# EAGLE design hybrid_lower_pcb3_2 (EAGLE 8.4.1)

## Sheet 1 of 8: micro,xbee,sd
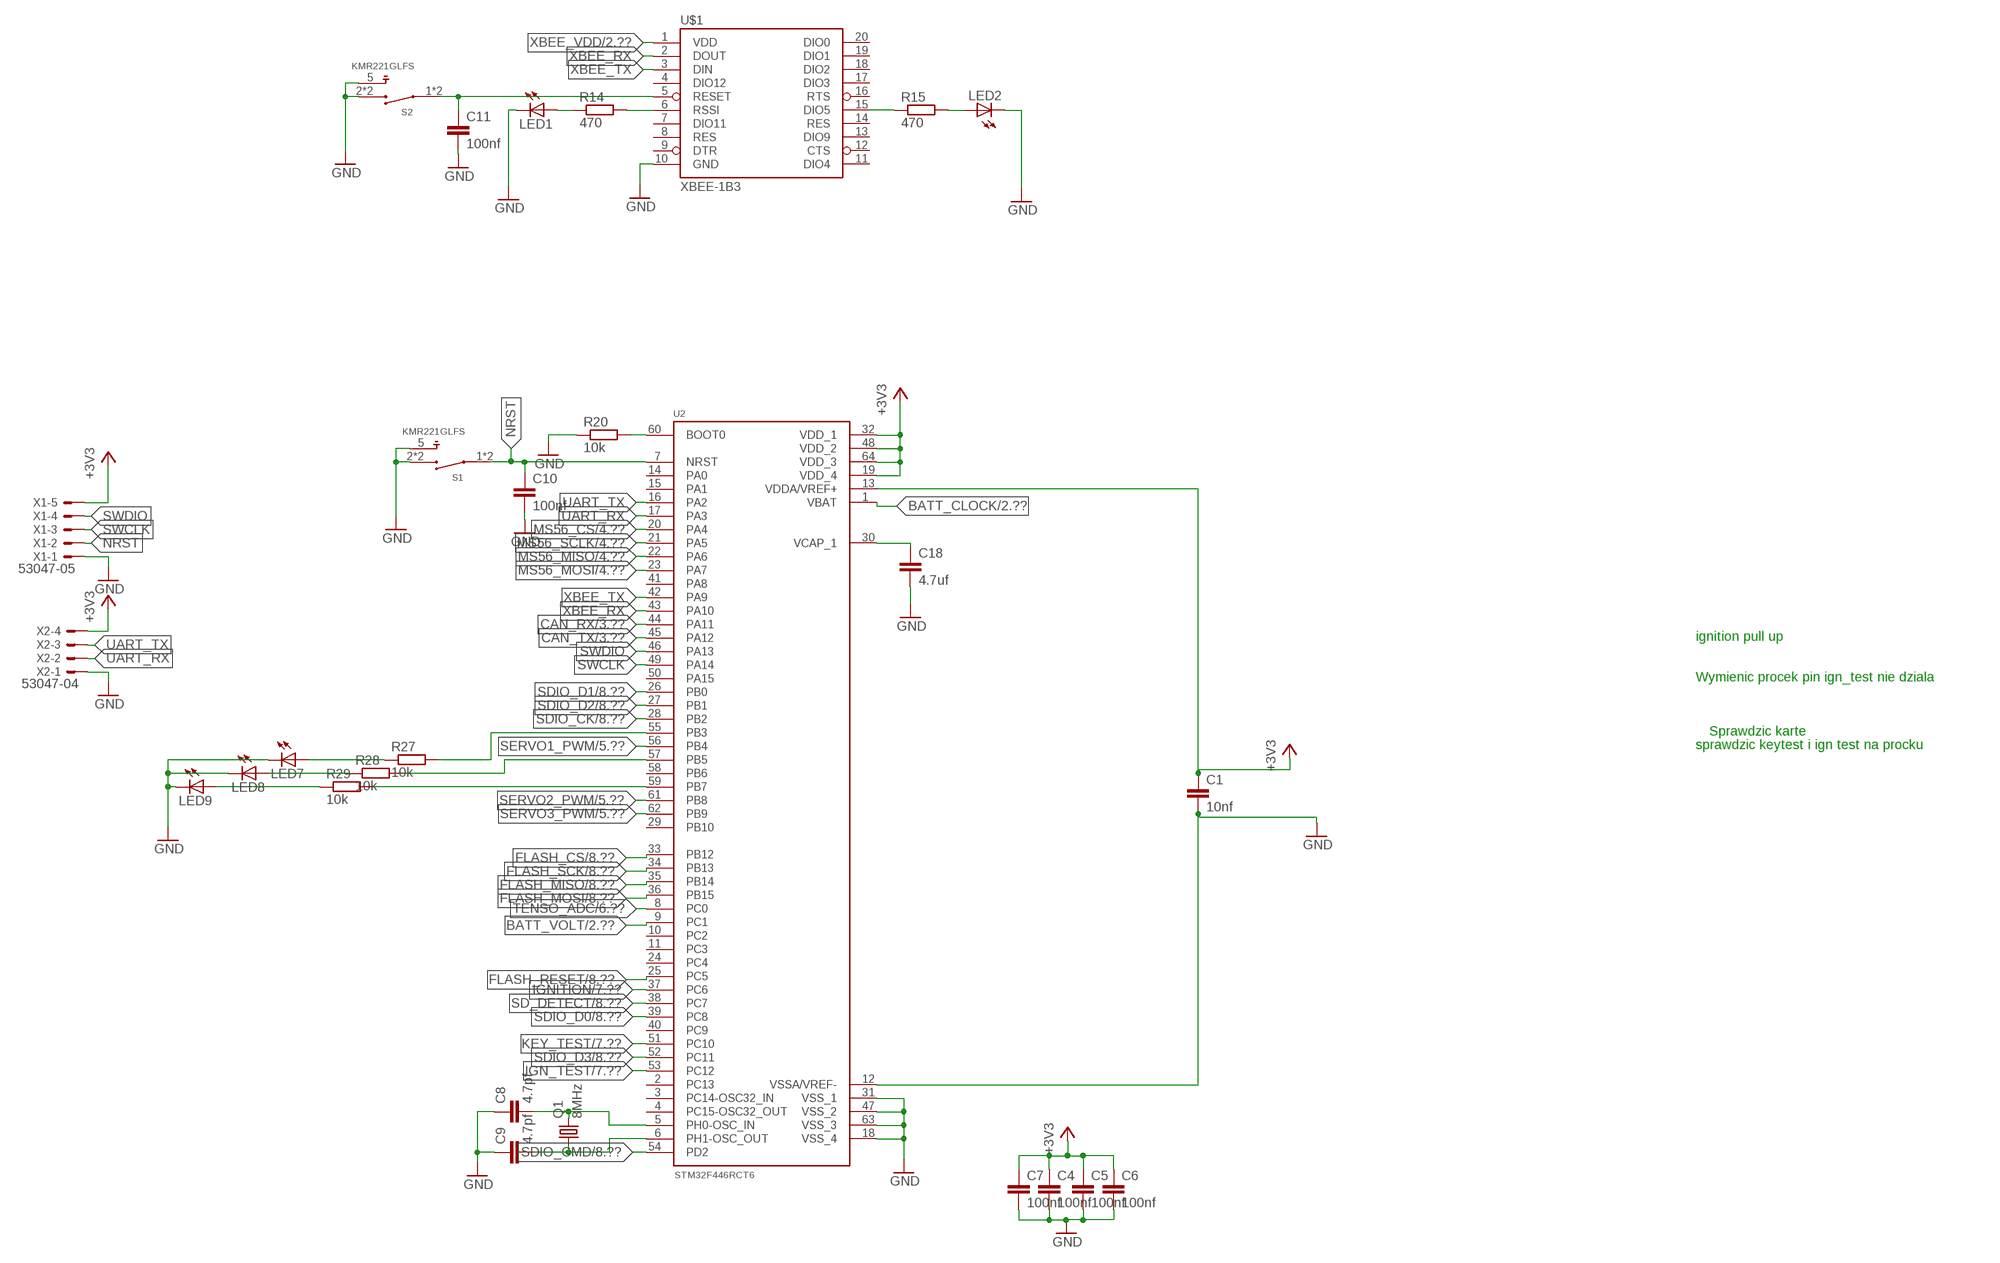
[diagram p0: schematic, sheet 1]

### Parts
C1  10nf  C-EUC0603  [C0603]
C4  100nf  C-EUC0603  [C0603]
C5  100nf  C-EUC0603  [C0603]
C6  100nf  C-EUC0603  [C0603]
C7  100nf  C-EUC0603  [C0603]
C8  4.7pf  C-EUC0603  [C0603]
C9  4.7pf  C-EUC0603  [C0603]
C10  100nf  C-EUC0603  [C0603]
C11  100nf  C-EUC0603  [C0603]
C18  4.7uf  C-EUC0805  [C0805]
LED1  LED0603  [LED-0603]
LED2  LED0603  [LED-0603]
LED7  LED0603  [LED-0603]
LED8  LED0603  [LED-0603]
LED9  LED0603  [LED-0603]
Q1  8MHz  CRYSTALCTS406  [CTS406]
R14  470  R-EU_R0603  [R0603]
R15  470  R-EU_R0603  [R0603]
R20  10k  R-EU_R0603  [R0603]
R27  10k  R-EU_R0603  [R0603]
R28  10k  R-EU_R0603  [R0603]
R29  10k  R-EU_R0603  [R0603]
S1  KMR221GLFS  [SW_KMR221GLFS]
S2  KMR221GLFS  [SW_KMR221GLFS]
U2  STM32F446RCT6  [QFP50P1200X1200X160-64N]
U$1  XBEE-1B3  [XBEE-SMD]
X1  53047-05  [53047-05]
X2  53047-04  [53047-04]

### Nets
+3V3: C1.1 C4.1 C5.1 C6.1 C7.1 U2.13(VDDA/VREF+) U2.19(VDD_4) U2.32(VDD_1) U2.48(VDD_2) U2.64(VDD_3) X1.5 X2.4 ; also sheet 2,3,4,7,8
BATT_CLOCK: U2.1(VBAT) ; also sheet 2
BATT_VOLT: U2.9(PC1) ; also sheet 2
CAN_RX: U2.44(PA11) ; also sheet 3
CAN_TX: U2.45(PA12) ; also sheet 3
DUPA: C11.1 S2.1 S2.4 U$1.5(RESET)
FLASH_CS: U2.33(PB12) ; also sheet 8
FLASH_MISO: U2.35(PB14) ; also sheet 8
FLASH_MOSI: U2.36(PB15) ; also sheet 8
FLASH_RESET: U2.25(PC5) ; also sheet 8
FLASH_SCK: U2.34(PB13) ; also sheet 8
GND: C1.2 C4.2 C5.2 C6.2 C7.2 C8.1 C9.1 C10.2 C11.2 C18.2 LED1.C LED2.C LED7.C LED8.C LED9.C R20.1 S1.2 S1.3 S1.5 S2.2 S2.3 S2.5 U2.12(VSSA/VREF-) U2.18(VSS_4) U2.31(VSS_1) U2.47(VSS_2) U2.63(VSS_3) U$1.10(GND) X1.1 X2.1 ; also sheet 2,3,4,5,6,7,8
IGN_TEST: U2.53(PC12) ; also sheet 7
IGNITION: U2.37(PC6) ; also sheet 7
KEY_TEST: U2.51(PC10) ; also sheet 7
MS56_CS: U2.20(PA4) ; also sheet 4
MS56_MISO: U2.22(PA6) ; also sheet 4
MS56_MOSI: U2.23(PA7) ; also sheet 4
MS56_SCLK: U2.21(PA5) ; also sheet 4
N$2: C18.1 U2.30(VCAP_1)
N$7: LED1.A R14.1
N$8: C8.2 Q1.3 U2.5(PH0-OSC_IN)
N$9: C9.2 Q1.1 U2.6(PH1-OSC_OUT)
N$11: LED2.A R15.2
N$18: R14.2 U$1.6(RSSI)
N$19: R15.1 U$1.15(DIO5)
N$29: R20.2 U2.60(BOOT0)
N$30: R27.2 U2.55(PB3)
N$33: R28.2 U2.57(PB5)
N$34: R29.2 U2.59(PB7)
N$36: LED7.A R27.1
N$37: LED8.A R28.1
N$38: LED9.A R29.1
NRST: C10.1 S1.1 S1.4 U2.7(NRST) X1.2
SD_DETECT: U2.38(PC7) ; also sheet 8
SDIO_CK: U2.28(PB2) ; also sheet 8
SDIO_CMD: U2.54(PD2) ; also sheet 8
SDIO_D0: U2.39(PC8) ; also sheet 8
SDIO_D1: U2.26(PB0) ; also sheet 8
SDIO_D2: U2.27(PB1) ; also sheet 8
SDIO_D3: U2.52(PC11) ; also sheet 8
SERVO1_PWM: U2.56(PB4) ; also sheet 5
SERVO2_PWM: U2.61(PB8) ; also sheet 5
SERVO3_PWM: U2.62(PB9) ; also sheet 5
SWCLK: U2.49(PA14) X1.3
SWDIO: U2.46(PA13) X1.4
TENSO_ADC: U2.8(PC0) ; also sheet 6
UART_RX: U2.17(PA3) X2.2
UART_TX: U2.16(PA2) X2.3
XBEE_RX: U2.43(PA10) U$1.2(DOUT)
XBEE_TX: U2.42(PA9) U$1.3(DIN)
XBEE_VDD: U$1.1(VDD) ; also sheet 2
Unconnected: U2.2(PC13) U2.3(PC14-OSC32_IN) U2.4(PC15-OSC32_OUT) U2.10(PC2) U2.11(PC3) U2.14(PA0) U2.15(PA1) U2.24(PC4) U2.29(PB10) U2.40(PC9) U2.41(PA8) U2.50(PA15) U2.58(PB6) U$1.4(DIO12) U$1.7(DIO11) U$1.8(RES) U$1.9(DTR) U$1.11(DIO4) U$1.12(CTS) U$1.13(DIO9) U$1.14(RES) U$1.16(RTS) U$1.17(DIO3) U$1.18(DIO2) U$1.19(DIO1) U$1.20(DIO0)

### Notes on the sheet
- ignition pull up
- Wymienic procek pin ign_test nie dziala
- Sprawdzic karte
- sprawdzic keytest i ign test na procku

## Sheet 2 of 8: supply
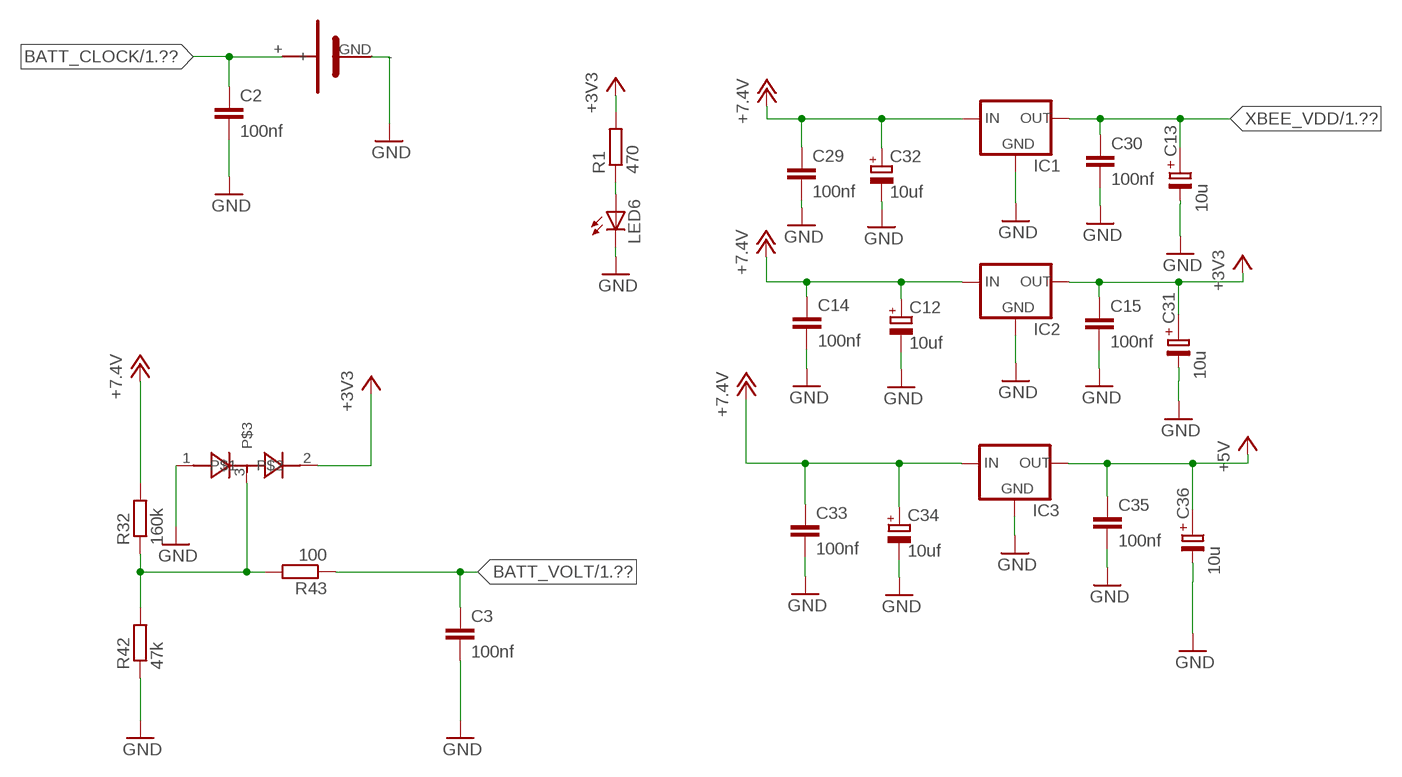
[diagram p1: schematic, sheet 2]

### Parts
C2  100nf  C-EUC0603  [C0603]
C3  100nf  C-EUC0603  [C0603]
C12  10uf  CPOL-EUSANYO_SMD_B6  [SANYO-OSCON_SMD_B6]
C13  10u  C-PR-SMD-TE-B  [TE-B-3528]
C14  100nf  C-EUC0603  [C0603]
C15  100nf  C-EUC0603  [C0603]
C29  100nf  C-EUC0603  [C0603]
C30  100nf  C-EUC0603  [C0603]
C31  10u  C-PR-SMD-TE-B  [TE-B-3528]
C32  10uf  CPOL-EUSANYO_SMD_B6  [SANYO-OSCON_SMD_B6]
C33  100nf  C-EUC0603  [C0603]
C34  10uf  CPOL-EUSANYO_SMD_B6  [SANYO-OSCON_SMD_B6]
C35  100nf  C-EUC0603  [C0603]
C36  10u  C-PR-SMD-TE-B  [TE-B-3528]
IC1  LM1117  [SOT223]
IC2  LM1117  [SOT223]
IC3  LM1117  [SOT223]
LED6  LED0603  [LED-0603]
R1  470  R-EU_R0603  [R0603]
R32  160k  R-EU_R0603  [R0603]
R42  47k  R-EU_R0603  [R0603]
R43  100  R-EU_R0603  [R0603]
U$13  CR1220_POZ  [CR1220_POZ]
U$17  BAS40W-04  [SOT65P210X110-3N]

### Nets
+3V3: C15.1 C31.+ IC2.2(OUT) R1.2 U$17.2 ; also sheet 1,3,4,7,8
+5V: C35.1 C36.+ IC3.2(OUT) ; also sheet 5,6
+12V: C12.+ C14.1 C29.1 C32.+ C33.1 C34.+ IC1.3(IN) IC2.3(IN) IC3.3(IN) R32.2 ; supply symbol labelled +7.4V ; also sheet 5,7
BATT_CLOCK: C2.1 U$13.+ ; also sheet 1
BATT_VOLT: C3.1 R43.1 ; also sheet 1
GND: C2.2 C3.2 C12.- C13.- C14.2 C15.2 C29.2 C30.2 C31.- C32.- C33.2 C34.- C35.2 C36.- IC1.1(GND) IC2.1(GND) IC3.1(GND) LED6.C R42.1 U$13.GND(-) U$17.1 ; also sheet 1,3,4,5,6,7,8
N$6: R32.1 R42.2 R43.2 U$17.3
N$28: LED6.A R1.1
XBEE_VDD: C13.+ C30.1 IC1.2(OUT) ; also sheet 1

## Sheet 3 of 8: CAN
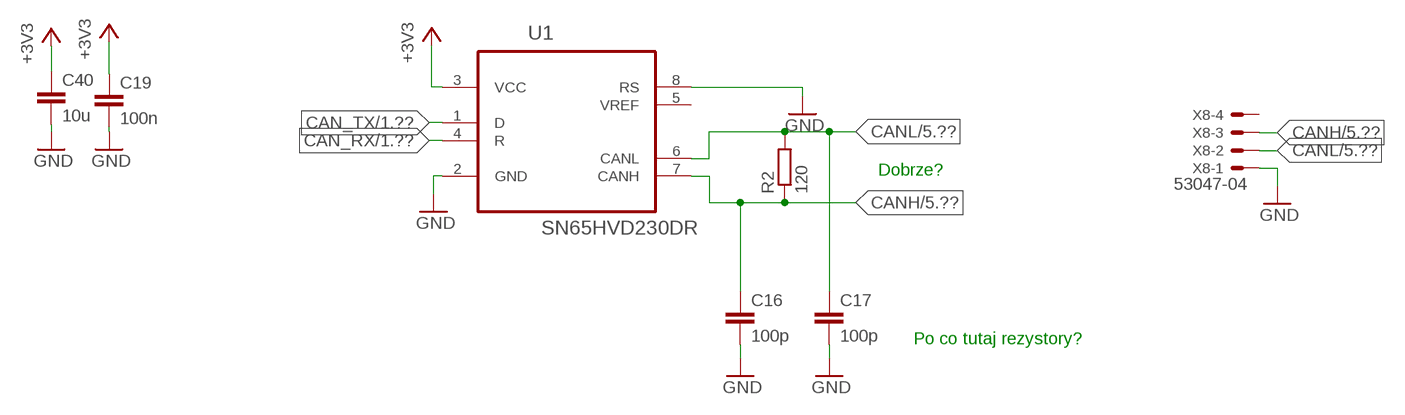
[diagram p2: schematic, sheet 3]

### Parts
C16  100p  C-EUC0603  [C0603]
C17  100p  C-EUC0603  [C0603]
C19  100n  C-EUC0603  [C0603]
C40  10u  C-EUC0805  [C0805]
R2  120  R-EU_R0603  [R0603]
U1  SN65HVD230DR  [SOIC127P600X175-8N]
X8  53047-04  [53047-04]

### Nets
+3V3: C19.1 C40.1 U1.3(VCC) ; also sheet 1,2,4,7,8
CAN_RX: U1.4(R) ; also sheet 1
CAN_TX: U1.1(D) ; also sheet 1
CANH: C16.1 R2.1 U1.7(CANH) X8.3 ; also sheet 5
CANL: C17.1 R2.2 U1.6(CANL) X8.2 ; also sheet 5
GND: C16.2 C17.2 C19.2 C40.2 U1.2(GND) U1.8(RS) X8.1 ; also sheet 1,2,4,5,6,7,8
Unconnected: U1.5(VREF) X8.4

### Notes on the sheet
- Dobrze?
- Po co tutaj rezystory?

## Sheet 4 of 8: Altimeter
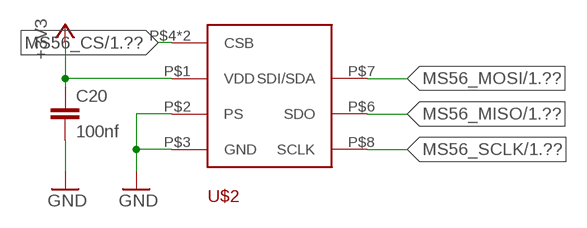
[diagram p3: schematic, sheet 4]

### Parts
C20  100nf  C-EUC0603  [C0603]
U$2  MS56XX  [MS56XX]

### Nets
+3V3: C20.1 U$2.P$1(VDD) ; also sheet 1,2,3,7,8
GND: C20.2 U$2.P$2(PS) U$2.P$3(GND) ; also sheet 1,2,3,5,6,7,8
MS56_CS: U$2.P$4(CSB) U$2.P$5(CSB) ; also sheet 1
MS56_MISO: U$2.P$6(SDO) ; also sheet 1
MS56_MOSI: U$2.P$7(SDI/SDA) ; also sheet 1
MS56_SCLK: U$2.P$8(SCLK) ; also sheet 1

## Sheet 5 of 8: connection
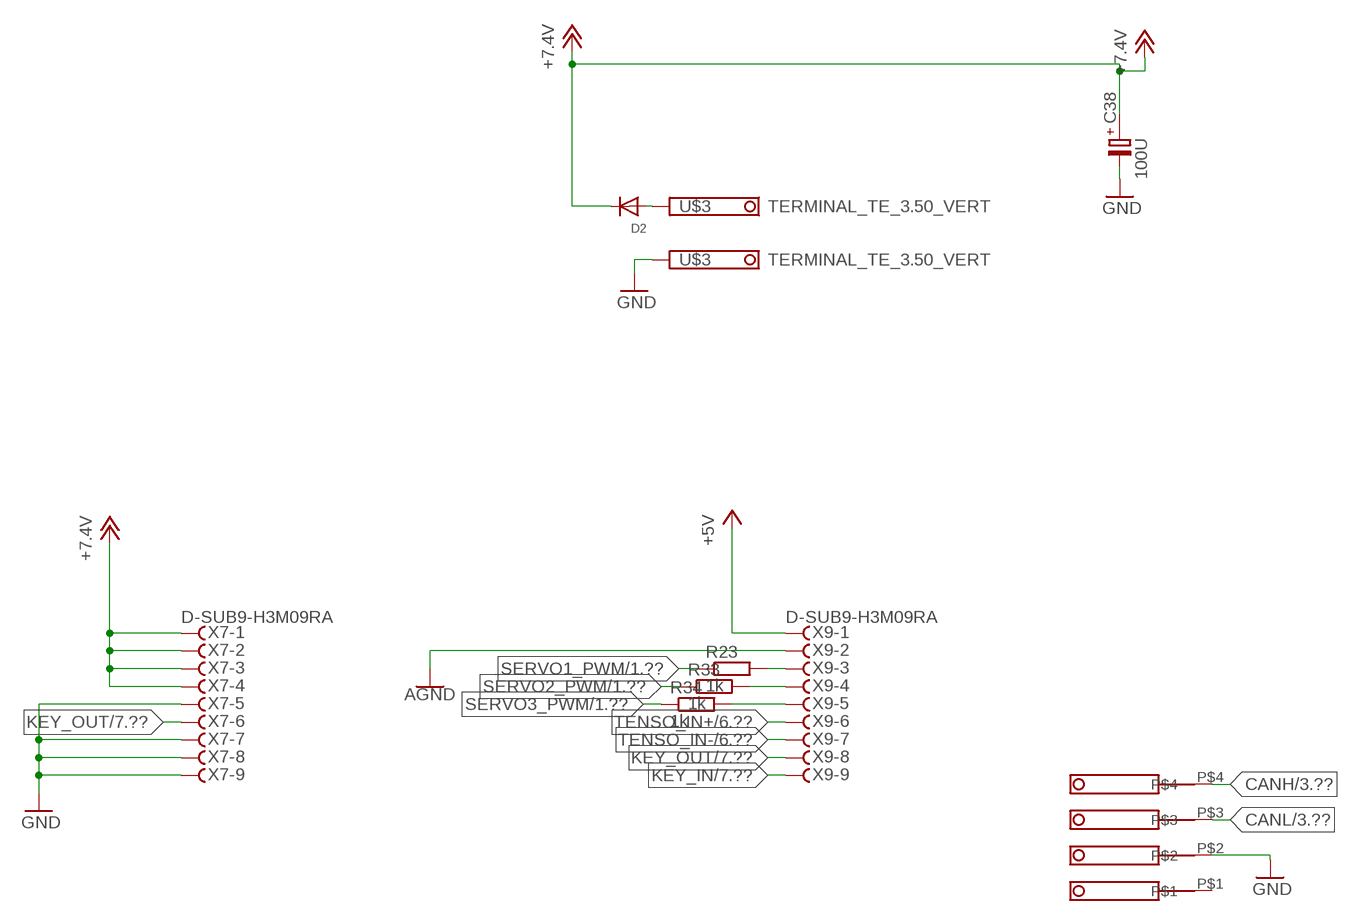
[diagram p4: schematic, sheet 5]

### Parts
C38  100U  C-PR-SMD-TE-B  [TE-B-3528]
D2  DIODESOD-523  [SOD-523]
R23  1k  R-EU_R0603  [R0603]
R33  1k  R-EU_R0603  [R0603]
R34  1k  R-EU_R0603  [R0603]
U$3  TERMINAL_TE_3.50_VERT  [TE_3.5_TERMINAL_VERT]
U$10  39505-1005  [39505-1005]
X7  D-SUB9-H3M09RA  [H3M09RA]
X9  D-SUB9-H3M09RA  [H3M09RA]

### Nets
+5V: X9.1 ; also sheet 2,6
+12V: C38.+ D2.K(C) X7.1 X7.2 X7.3 X7.4 ; supply symbol labelled +7.4V ; also sheet 2,7
AGND: X9.2 ; also sheet 6
CANH: U$10.P$4 ; also sheet 3
CANL: U$10.P$3 ; also sheet 3
GND: C38.- U$3.P$2(K1) U$10.P$2 X7.5 X7.7 X7.8 X7.9 ; also sheet 1,2,3,4,6,7,8
KEY_IN: X9.9 ; also sheet 7
KEY_OUT: X7.6 X9.8 ; also sheet 7
N$17: D2.A U$3.P$1(K)
N$22: R23.2 X9.3
N$23: R33.2 X9.4
N$24: R34.2 X9.5
SERVO1_PWM: R23.1 ; also sheet 1
SERVO2_PWM: R33.1 ; also sheet 1
SERVO3_PWM: R34.1 ; also sheet 1
TENSO_IN+: X9.6 ; also sheet 6
TENSO_IN-: X9.7 ; also sheet 6
Unconnected: U$10.P$1

## Sheet 6 of 8
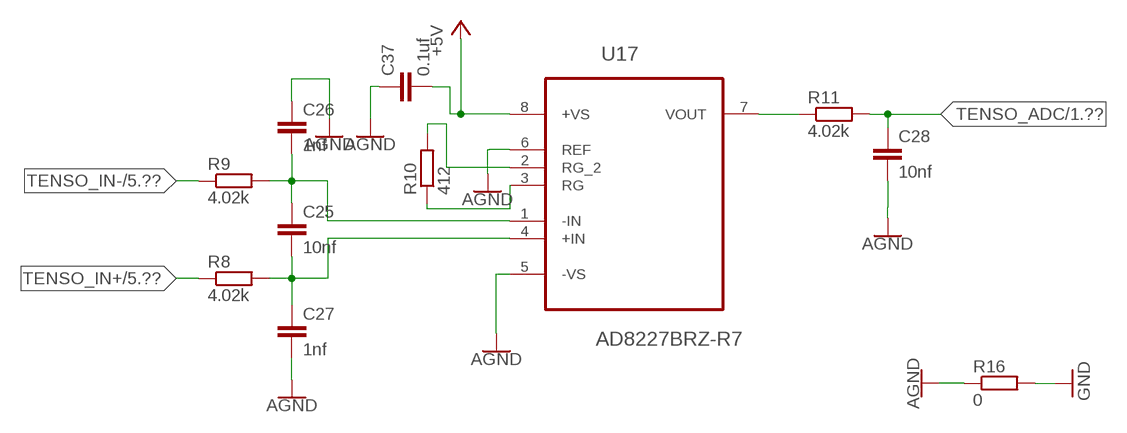
[diagram p5: schematic, sheet 6]

### Parts
C25  10nf  C-EUC0603  [C0603]
C26  1nf  C-EUC0603  [C0603]
C27  1nf  C-EUC0603  [C0603]
C28  10nf  C-EUC0603  [C0603]
C37  0.1uf  C-EUC0603  [C0603]
R8  4.02k  R-EU_R0603  [R0603]
R9  4.02k  R-EU_R0603  [R0603]
R10  412  R-EU_R0805  [R0805]
R11  4.02k  R-EU_R0603  [R0603]
R16  0  R-EU_R0603  [R0603]
U17  AD8227BRZ-R7  [SOIC127P600X175-8N]

### Nets
+5V: C37.2 U17.8(+VS) ; also sheet 2,5
AGND: C26.1 C27.2 C28.2 C37.1 R16.1 U17.5(-VS) U17.6(REF) ; also sheet 5
GND: R16.2 ; also sheet 1,2,3,4,5,7,8
N$3: C25.1 C26.2 R9.2 U17.1(-IN)
N$4: C25.2 C27.1 R8.2 U17.4(+IN)
N$10: R10.1 U17.3(RG)
N$15: R10.2 U17.2(RG_2)
N$16: R11.1 U17.7(VOUT)
TENSO_ADC: C28.1 R11.2 ; also sheet 1
TENSO_IN+: R8.1 ; also sheet 5
TENSO_IN-: R9.1 ; also sheet 5

## Sheet 7 of 8: Ignition
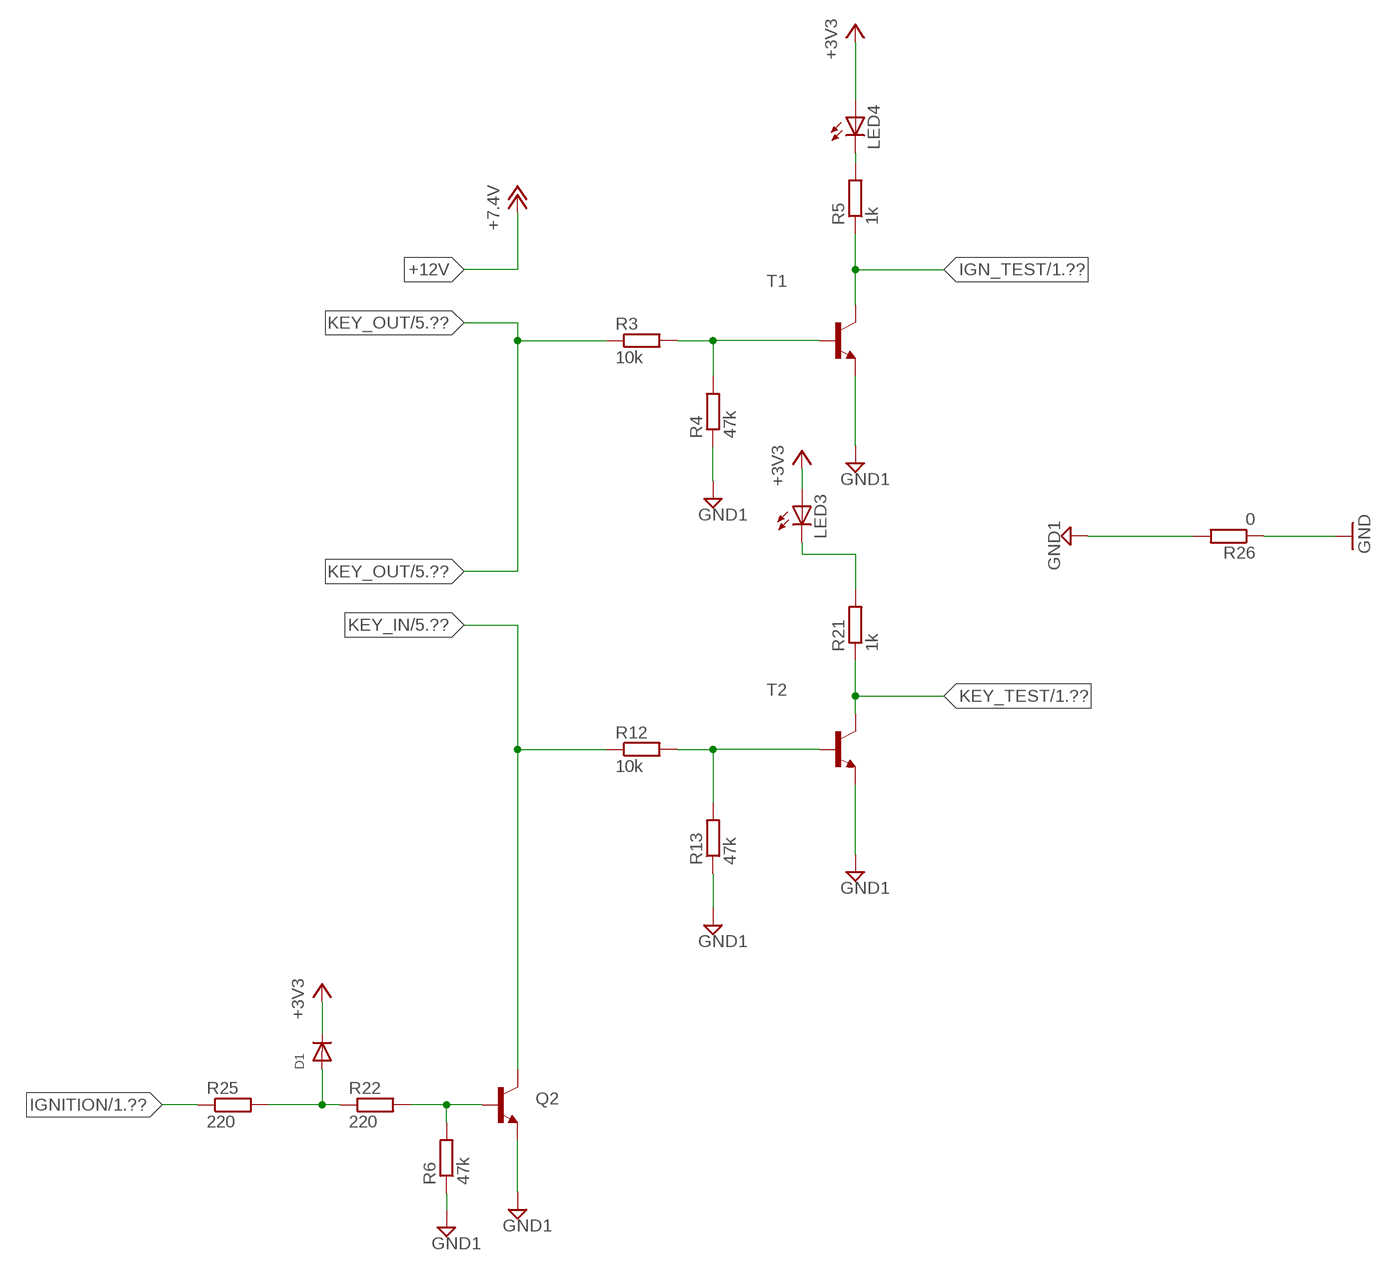
[diagram p6: schematic, sheet 7]

### Parts
D1  DIODESOD-523  [SOD-523]
LED3  LED0603  [LED-0603]
LED4  LED0603  [LED-0603]
Q2  TRANSISTOR_NPNSOT23-3  [SOT23-3]
R3  10k  R-EU_R0603  [R0603]
R4  47k  R-EU_R0603  [R0603]
R5  1k  R-EU_R0603  [R0603]
R6  47k  R-EU_R0603  [R0603]
R12  10k  R-EU_R0603  [R0603]
R13  47k  R-EU_R0603  [R0603]
R21  1k  R-EU_R0603  [R0603]
R22  220  R-EU_R0603  [R0603]
R25  220  R-EU_R0603  [R0603]
R26  0  R-EU_R0603  [R0603]
T1  BCW81-NPN-SOT23-BEC  [SOT23-BEC]
T2  BCW81-NPN-SOT23-BEC  [SOT23-BEC]

### Nets
+3V3: D1.K(C) LED3.A LED4.A ; also sheet 1,2,3,4,8
GND: R26.1 ; also sheet 1,2,3,4,5,6,8
GND1: Q2.2(E) R4.1 R6.1 R13.1 R26.2 T1.E T2.E
IGN_TEST: R5.1 T1.C ; also sheet 1
IGNITION: R25.1 ; also sheet 1
KEY_IN: Q2.3(C) R12.1 ; also sheet 5
KEY_OUT: R3.1 ; also sheet 5
KEY_TEST: R21.1 T2.C ; also sheet 1
N$5: R3.2 R4.2 T1.B
N$12: R12.2 R13.2 T2.B
N$20: LED4.C R5.2
N$21: LED3.C R21.2
N$31: Q2.1(B) R6.2 R22.2
N$35: D1.A R22.1 R25.2

## Sheet 8 of 8: Memory
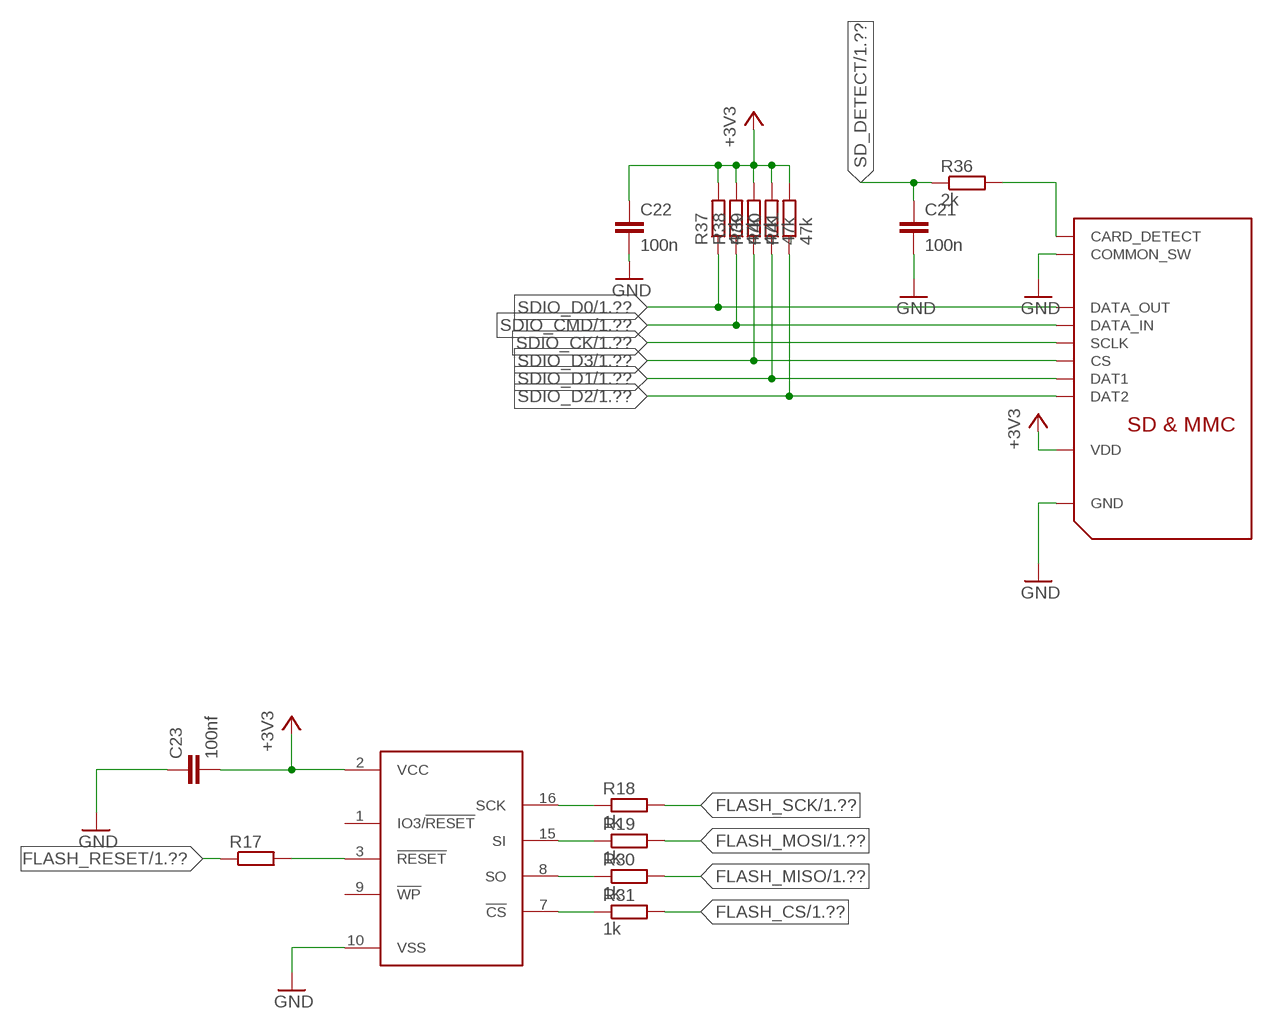
[diagram p7: schematic, sheet 8]

### Parts
C21  100n  C-EUC0603K  [C0603K]
C22  100n  C-EUC0603K  [C0603K]
C23  100nf  C-EUC0603  [C0603]
R17  R-EU_R0603  [R0603]
R18  1k  R-EU_R0603  [R0603]
R19  1k  R-EU_R0603  [R0603]
R30  1k  R-EU_R0603  [R0603]
R31  1k  R-EU_R0603  [R0603]
R36  2k  R-EU_R0603  [R0603]
R37  47k  R-EU_R0603  [R0603]
R38  47k  R-EU_R0603  [R0603]
R39  47k  R-EU_R0603  [R0603]
R40  47k  R-EU_R0603  [R0603]
R41  47k  R-EU_R0603  [R0603]
U$11  S25FLX  [SOIC16]
U$16  MOLEX_MICRO_SD_503182-1853  [MOLEX_MICRO_SD_503182-1853]

### Nets
+3V3: C22.1 C23.2 R37.2 R38.2 R39.2 R40.2 R41.2 U$11.2(VCC) U$16.PIN4(VDD) ; also sheet 1,2,3,4,7
FLASH_CS: R31.2 ; also sheet 1
FLASH_MISO: R30.2 ; also sheet 1
FLASH_MOSI: R19.2 ; also sheet 1
FLASH_RESET: R17.1 ; also sheet 1
FLASH_SCK: R18.2 ; also sheet 1
GND: C21.2 C22.2 C23.1 U$11.10(VSS) U$16.DETECT_GND(COMMON_SW) U$16.PIN6(GND) ; also sheet 1,2,3,4,5,6,7
N$1: R36.2 U$16.DETECT(CARD_DETECT)
N$14: R17.2 U$11.3(!RESET)
N$25: R18.1 U$11.16(SCK)
N$32: R19.1 U$11.15(SI)
N$39: R30.1 U$11.8(SO)
N$40: R31.1 U$11.7(!CS)
SD_DETECT: C21.1 R36.1 ; also sheet 1
SDIO_CK: U$16.PIN5(SCLK) ; also sheet 1
SDIO_CMD: R38.1 U$16.PIN3(DATA_IN) ; also sheet 1
SDIO_D0: R37.1 U$16.PIN7(DATA_OUT) ; also sheet 1
SDIO_D1: R40.1 U$16.PIN8(DAT1) ; also sheet 1
SDIO_D2: R41.1 U$16.PIN1(DAT2) ; also sheet 1
SDIO_D3: R39.1 U$16.PIN2(CS) ; also sheet 1
Unconnected: U$11.1(IO3/!RESET) U$11.9(!WP)

## Library data of the parts
C1 C2 C4-C11 C14-C17 C19 C21 C22 C25-C30 C33 C35 C37 C40 = rcl:C-EU: CAPACITOR, European symbol
C3 C18 C23 = rcl:C-EU: CAPACITOR, European symbol; SPICEPREFIX: C
C12 C32 C34 = rcl:CPOL-EU: POLARIZED CAPACITOR, European symbol; SPICEPREFIX: C
C13 C31 C36 C38 = capacitors:C-PR: POLARIZED ELECTROLYTIC/TANTALUM
C20 = resistor:C-EU: CAPACITOR, European symbol
D1 D2 = adafruit:DIODE: Diode SMADIODE - SMA Surface Mount Package 20V 1A Schottky Diode Digikey: 641-1014-6-ND DO-1N4148 - Through Hole Small Current Diode SOD-123 20V 1 A (.5mV Vf) Schottky Diode - Digikey: MBRX120TPMSCT-ND SOD-323 10V 570mA (.38mV Vf, 3ns) Schottky Diode - Digikey: ZLLS410CT-ND SOD-523 30V 30mA Schottky Diode (RB751S-40TE61) - Digikey: RB751S-40TE61CT-ND SOT23-R/W - SOT23 Package (R = Solder Paste/Reflow Ovens, W = Hand-Soldering) BAT54Film 40V 300mA - Digikey: 497-7162-1-ND
IC1-IC3 = v-reg-3:LM1117
LED1-LED4 LED6-LED9 = SparkFun:LED: LEDs Standard schematic elements and footprints for 5mm, 3mm, 1206, and 0603 sized LEDs. 5mm - Spark Fun Electronics SKU : COM-00529 (and others)
Q1 = crystal:CRYSTAL: CRYSTAL; OC_FARNELL: unknown; OC_NEWARK: unknown
Q2 = SparkFun:TRANSISTOR_NPN: Transistor NPN BJT configuration in SOT23 package. MMBT2222 is the common NPN we use. Double check BCE configuration again layout.
R1 R16 R20 R27-R29 = resistor:R-EU_: RESISTOR, European symbol
R2-R6 R8-R15 R21 R22 R25 R26 R36-R41 = rcl:R-EU_: RESISTOR, European symbol
R17-R19 R23 R30-R34 R42 R43 = rcl:R-EU_: RESISTOR, European symbol; SPICEPREFIX: R
S1 S2 = KMR221GLFS:KMR221GLFS: Switch Tactile N.O. SPST Button Gull Wing 0.05A 32VDC 1VA 200000Cycles 2N SMD Automotive T/R; AVAILABILITY: Good; DESCRIPTION: Switch Tactile N.O. SPST Button Gull Wing 0.05A 32VDC 1VA 200000Cycles 2N SMD Automotive T/R; MF: C&K Components; MP: KMR221GLFS; PACKAGE: None; PRICE: 0.28 USD
T1 T2 = DC_LOAD_AU:*-NPN-: NPN Transistror BF959 corrected 2008.03.06
U1 = SN65HVD230DR:SN65HVD230DR: 3.3-V CAN TRANSCEIVERS; AVAILABILITY: Good; DESCRIPTION: 3.3V CAN Transceiver with Standby Mode 8-SOIC -40 to 85; MF: Texas Instruments; MP: SN65HVD230DR; PACKAGE: SOIC-8 Texas Instruments; PRICE: 1.59 USD
U2 = STM32F446RCT6:STM32F446RCT6: 32 Bit Microcontroller, High Performance, ARM Cortex-M4, 180 MHz, 256 KB, 128 KB, 64, LQFP; AVAILABILITY: Good; DESCRIPTION: 32 Bit Microcontroller, High Performance, ARM Cortex-M4, 180 MHz, 256 KB, 128 KB, 64, LQFP; MF: STMicroelectronics; MP: STM32F446RCT6; PACKAGE: LQFP-64 STMicroelectronics; PRICE: 5.57 USD
U17 = Analog Devices_By_element14_Batch_1:AD8227BRZ-R7: Wide Supply Range, Rail-to-Rail Output Instrumentation Amplifier; MPN: AD8227BRZ-R7; OC_FARNELL: -; OC_NEWARK: 14R8723; PACKAGE: SOIC-8; SUPPLIER: Analog Devices
U$1 = SparkFun:XBEE-1
U$2 = MS56XX:MS56XX
U$3 = Terminal_TE_3.50:TERMINAL_TE_3.50_VERT
U$10 = 39505-1005:39505-1005
U$11 = s25FL:S25FLX
U$13 = SS_coin:CR1220_POZ
U$16 = SD_Reader:MOLEX_MICRO_SD_503182-1853
U$17 = BAS40w-0:BAS40W-04
X1 = con-molex:53?-05: CONNECTOR wire to board 1.25 mm (.049 inch) pitch header; MF: MOLEX; MPN: 53047-0510; OC_FARNELL: 9732861; OC_NEWARK: 38C9901
X2 X8 = con-molex:53?-04: CONNECTOR wire to board 1.25 mm (.049 inch) pitch header; MF: WALDOM/MOLEX; MPN: 53047-0410; OC_FARNELL: 9733060; OC_NEWARK: 38C9900
X7 X9 = con-thomas-betts:D-SUB9-: D-Subminiatur Connector Source: Electronioc Interconnects European Edition 1998; OC_FARNELL: unknown; OC_NEWARK: unknown

## Board
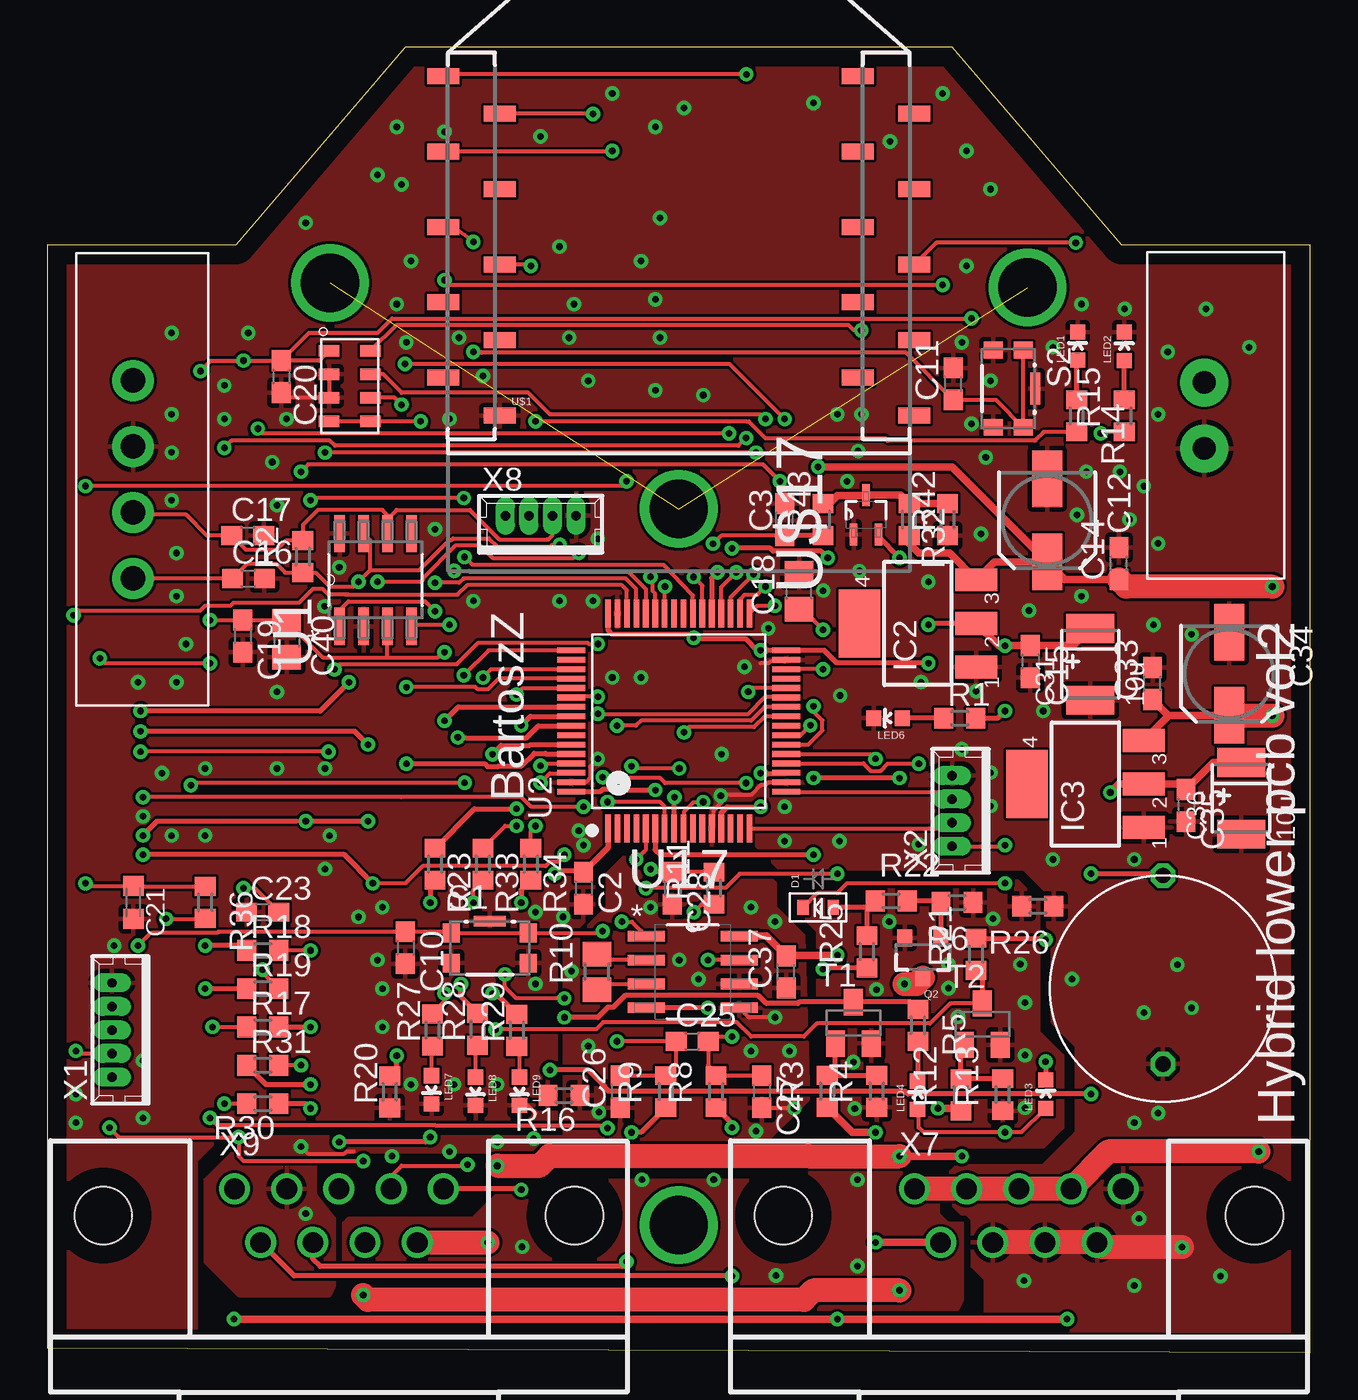
[diagram p8: board, top side]
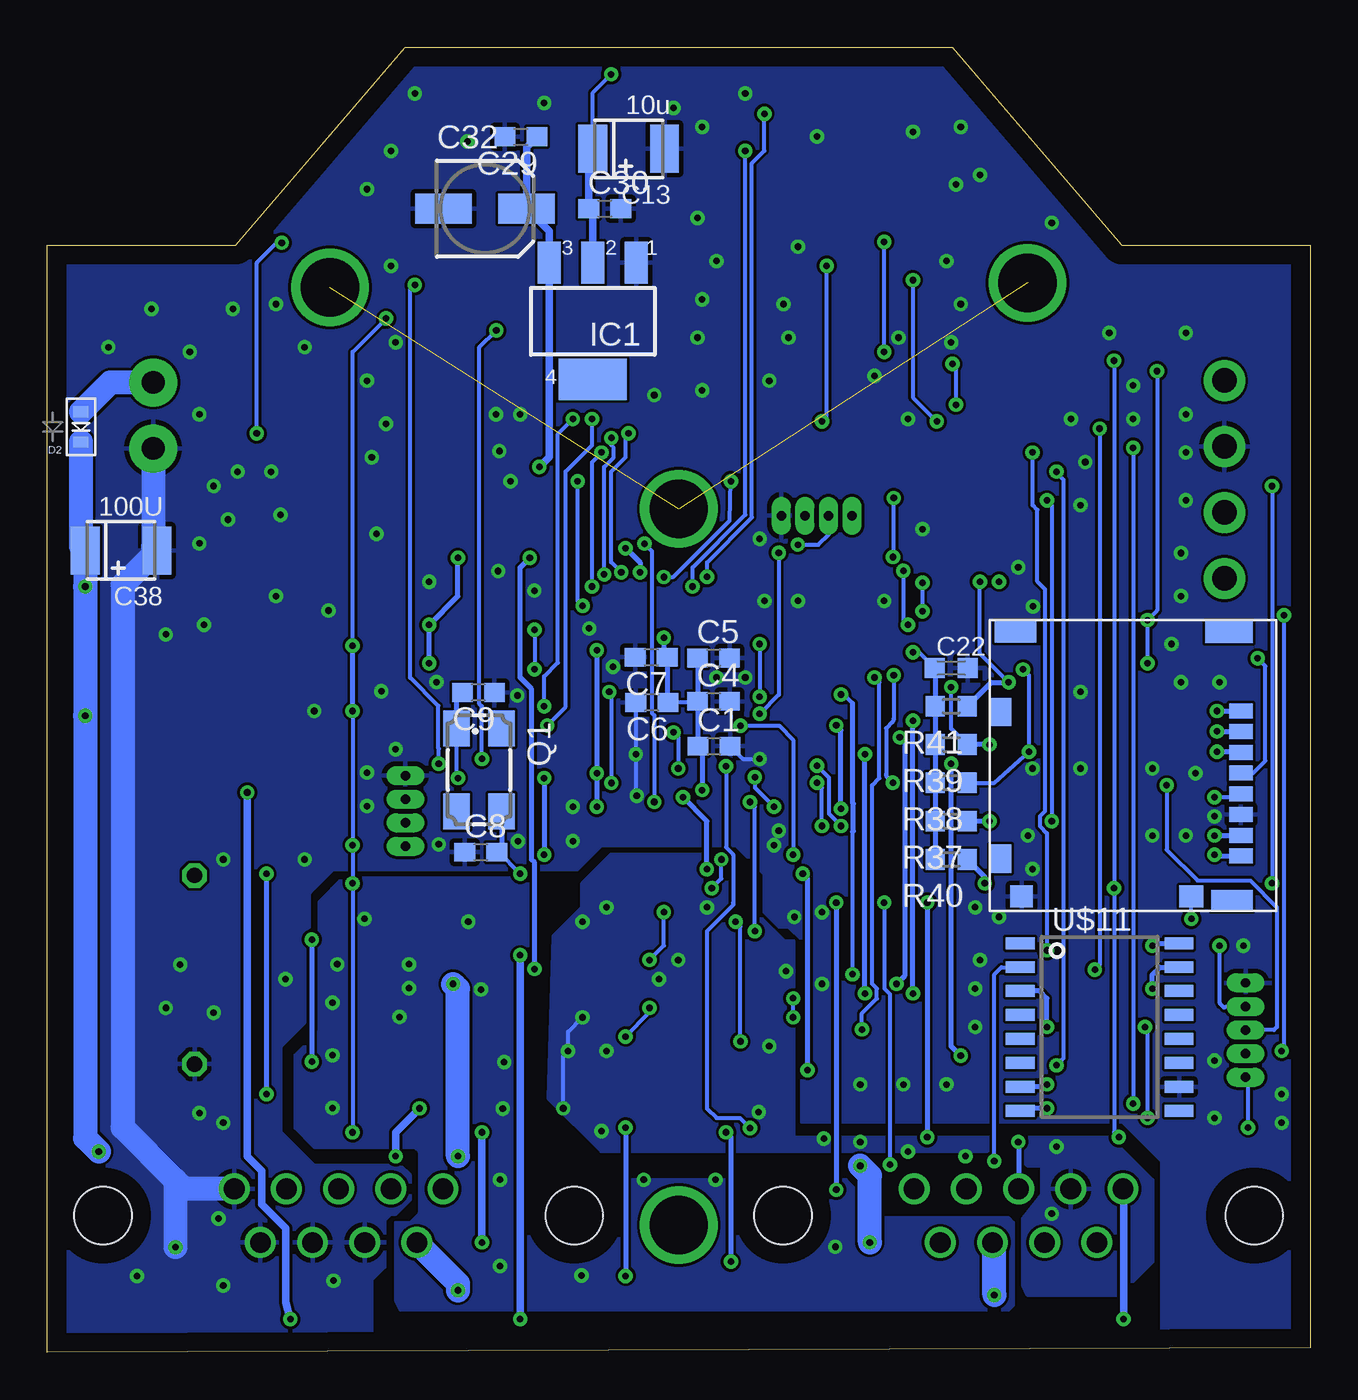
[diagram p9: board, bottom side, seen from below]

Size 67 x 69.25 mm. Coordinates in mm from the lower left corner, seen from the top.
Outline: 0,0.25 67,0 67,58.75 57,58.75 48,69.25 19,69.25 10,58.75 0,58.75 0,0.25
Copper layers (1*16): Top 0.035mm / dielectric 1.5mm / Bottom 0.035mm
Design rules "default *": minimum track width 6mil, minimum drill 0.35mm, track to track 6mil, track to pad 6mil, pad to pad 6mil, via to via 6mil, smd to smd 6mil, copper to edge 40mil, drill to drill 6mil, minimum pad ring 10mil, minimum via ring 8mil, stop-mask expansion 4mil, vias tented up to drill 15mil, thermal gap 10mil

### Footprints (pad centres in the part's own frame; a part is rotated, then mirrored left to right if it is on the bottom)
C0603 = smd 1.1 x 1: 1 -0.85,0; 2 0.85,0
SANYO-OSCON_SMD_B6 = smd 3 x 1.6: + 2.2,0; - -2.2,0
TE-B-3528 = smd 1.524 x 2.54: + 1.905,0; - -1.905,0
C0805 = smd 1.3 x 1.5: 1 -0.95,0; 2 0.95,0
C0603K = smd 1.05 x 1.08: 1 -0.875,0; 2 0.875,0
SOD-523 = smd 0.8 x 0.6: A 0,-0.8; K 0,0.8
SOT223 = smd 1.219 x 2.235: 1 -2.311,-3.099; 2 0,-3.099; 3 2.311,-3.099 | smd 3.6 x 2.2: 4 0,3.099
LED-0603 = smd 0.8 x 0.8: A 0,-0.75; C 0,0.75
CTS406 = smd 1.9 x 1.4: 1 -2.2,-1.2; 2 2.2,-1.2; 3 2.2,1.2; 4 -2.2,1.2
SOT23-3 = smd 0.8 x 0.9: 1 -0.95,-1; 2 0.95,-1; 3 0,1.1
R0603 = smd 1 x 1.1: 1 -0.85,0; 2 0.85,0
R0805 = smd 1.3 x 1.5: 1 -0.95,0; 2 0.95,0
SW_KMR221GLFS = smd 0.9 x 1: 1 -2.05,0.8; 2 -2.05,-0.8; 3 2.05,-0.8; 4 2.05,0.8 | smd 1.7 x 0.55: 5 0,1.425
SOT23-BEC = smd 1 x 1.4: B -0.95,-1.1; C 0,1.1; E 0.95,-1.1
SOIC127P600X175-8N = smd 1.981 x 0.559: 1 -2.464,1.905; 2 -2.464,0.635; 3 -2.464,-0.635; 4 -2.464,-1.905; 5 2.464,-1.905; 6 2.464,-0.635; 7 2.464,0.635; 8 2.464,1.905
QFP50P1200X1200X160-64N = smd 1.5 x 0.3: 1 -5.7,3.75; 2 -5.7,3.25; 3 -5.7,2.75; 4 -5.7,2.25; 5 -5.7,1.75; 6 -5.7,1.25; 7 -5.7,0.75; 8 -5.7,0.25; 9 -5.7,-0.25; 10 -5.7,-0.75; 11 -5.7,-1.25; 12 -5.7,-1.75; 13 -5.7,-2.25; 14 -5.7,-2.75; 15 -5.7,-3.25; 16 -5.7,-3.75; 33 5.7,-3.75; 34 5.7,-3.25; 35 5.7,-2.75; 36 5.7,-2.25; 37 5.7,-1.75; 38 5.7,-1.25; 39 5.7,-0.75; 40 5.7,-0.25; 41 5.7,0.25; 42 5.7,0.75; 43 5.7,1.25; 44 5.7,1.75; 45 5.7,2.25; 46 5.7,2.75; 47 5.7,3.25; 48 5.7,3.75 | smd 0.3 x 1.5: 17 -3.75,-5.7; 18 -3.25,-5.7; 19 -2.75,-5.7; 20 -2.25,-5.7; 21 -1.75,-5.7; 22 -1.25,-5.7; 23 -0.75,-5.7; 24 -0.25,-5.7; 25 0.25,-5.7; 26 0.75,-5.7; 27 1.25,-5.7; 28 1.75,-5.7; 29 2.25,-5.7; 30 2.75,-5.7; 31 3.25,-5.7; 32 3.75,-5.7; 49 3.75,5.7; 50 3.25,5.7; 51 2.75,5.7; 52 2.25,5.7; 53 1.75,5.7; 54 1.25,5.7; 55 0.75,5.7; 56 0.25,5.7; 57 -0.25,5.7; 58 -0.75,5.7; 59 -1.25,5.7; 60 -1.75,5.7; 61 -2.25,5.7; 62 -2.75,5.7; 63 -3.25,5.7; 64 -3.75,5.7
XBEE-SMD = smd 1.7 x 0.85: 1 -12.5,20; 2 -9.5,18; 3 -12.5,16; 4 -9.5,14; 5 -12.5,12; 6 -9.5,10; 7 -12.5,8; 8 -9.5,6; 9 -12.5,4; 10 -9.5,2; 11 12.5,2; 12 9.5,4; 13 12.5,6; 14 9.5,8; 15 12.5,10; 16 9.5,12; 17 12.5,14; 18 9.5,16; 19 12.5,18; 20 9.5,20
MS56XX = smd 1.1 x 0.6: P$1 -1.1,1.875; P$2 -1.1,0.625; P$3 -1.1,-0.625; P$4 -1.1,-1.875; P$5 1.1,-1.875; P$6 1.1,-0.625; P$7 1.1,0.625; P$8 1.1,1.875
TE_3.5_TERMINAL_VERT = drill 1.2 pad 2.54: P$1 1.75,-3; P$2 -1.75,-3
39505-1005 = drill 1.3 pad 2.184: P$1 -5.41,3.46; P$2 -1.91,3.46; P$3 1.59,3.46; P$4 5.09,3.46
SOIC16 = smd 0.635 x 1.524: 1 -4.445,-4.215; 2 -3.175,-4.215; 3 -1.905,-4.215; 4 -0.635,-4.215; 5 0.635,-4.215; 6 1.905,-4.215; 7 3.175,-4.215; 8 4.445,-4.215; 9 4.445,4.215; 10 3.175,4.215; 11 1.905,4.215; 12 0.635,4.215; 13 -0.635,4.215; 14 -1.905,4.215; 15 -3.175,4.215; 16 -4.445,4.215
CR1220_POZ = drill 0.8 octagon: + 6,0; GND -4,0
MOLEX_MICRO_SD_503182-1853 = smd 1.16 x 1.25: DETECT 14.66,10.7 | smd 1.16 x 1.2: DETECT_GND 14.66,1.7 | smd 1.15 x 2.5: P$9 0.635,12.7 | smd 1.15 x 2.2: P$10 0.625,1.37 | smd 1.5 x 1.15: P$11 4.88,0.575; P$12 12.66,0.575 | smd 1.12 x 2.2: P$15 14.865,12.85 | smd 0.8 x 1.24: PIN1 4.82,13.33; PIN2 5.92,13.33; PIN3 7.02,13.33; PIN4 8.12,13.33; PIN5 9.22,13.33; PIN6 10.32,13.33; PIN7 11.42,13.33; PIN8 12.52,13.33
SOT65P210X110-3N = smd 1.168 x 0.406: 1 -1.041,0.66; 2 -1.041,-0.66; 3 1.041,0
53047-05 = drill 0.5 pad 0.698 long: 1 2.5,0.45; 2 1.25,0.45; 3 0,0.45; 4 -1.25,0.45; 5 -2.5,0.45
53047-04 = drill 0.5 pad 0.698 long: 1 1.875,0.45; 2 0.625,0.45; 3 -0.625,0.45; 4 -1.875,0.45
H3M09RA = drill 1.092: 1 -5.537,1.422; 2 -2.769,1.422; 3 0,1.422; 4 2.769,1.422; 5 5.537,1.422; 6 -4.153,-1.422; 7 -1.384,-1.422; 8 1.384,-1.422; 9 4.153,-1.422 | hole 3.048: -12.497,0; 12.497,0

### Placement (x,y rotation side)
C1  31.63,32.16 0 bottom
C2  28.45,24.63 270 top
C3  39.12,44.19 90 top
C4  31.65,34.54 0 bottom
C5  31.65,36.85 0 bottom
C6  34.93,34.48 180 bottom
C7  34.96,36.88 180 bottom
C8  44,26.54 0 bottom
C9  44.12,35.02 180 bottom
C10  19,21.47 270 top
C11  48.06,51.38 90 top
C12  53.04,44.14 270 top
C13  36.15,63.86 180 bottom
C14  56.85,41.85 90 top
C15  52.15,36.65 270 top
C16  10.68,41.06 0 top
C17  10.64,43.33 0 top
C18  39.88,40.38 90 top
C19  10.38,38 270 top
C20  12.41,51.77 270 top
C21  4.57,23.87 270 top
C22  19.05,36.31 0 bottom
C23  11.43,23.36 0 top
C25  34.21,16.5 0 top
C26  30.4,13.83 90 top
C27  37.89,13.83 270 top
C28  33.16,24.63 270 top
C29  41.87,64.49 180 bottom
C30  37.42,60.68 0 bottom
C31  55.33,36.5 90 top
C32  43.77,60.68 0 bottom
C33  58.63,35.49 90 top
C34  62.69,36 270 top
C35  60.41,29.01 270 top
C36  63.33,29.39 90 top
C37  39.2,20.19 90 top
C38  63.07,42.55 180 bottom
C40  12.7,37.84 270 top
D1  40.89,23.61 90 top
D2  65.21,49.1 180 bottom
IC1  38.06,54.71 180 bottom
IC2  46.18,38.68 90 top
IC3  55.07,30.16 90 top
LED1  54.65,53.39 0 top
LED2  57.13,53.37 0 top
LED3  52.96,13.71 0 top
LED4  46.16,13.64 0 top
LED6  44.6,33.65 90 top
LED7  20.39,13.93 180 top
LED8  22.72,13.85 180 top
LED9  25.05,13.85 180 top
Q1  44.09,30.91 270 bottom
Q2  46.45,20.99 180 top
R1  48.41,33.65 0 top
R2  13.56,42.22 90 top
R3  41.38,13.85 90 top
R4  44,13.85 90 top
R5  46.18,17.36 270 top
R6  48.26,23.87 180 top
R8  35.48,13.83 90 top
R9  32.81,13.83 90 top
R10  29.16,20.19 90 top
R11  35.37,24.63 90 top
R12  48.47,13.67 90 top
R13  50.68,13.68 90 top
R14  54.61,49.69 270 top
R15  57.13,49.69 90 top
R16  27.41,13.63 180 top
R17  11.43,17.26 0 top
R18  11.43,21.33 0 top
R19  11.43,19.3 0 top
R20  18.17,13.82 90 top
R21  49.27,21.12 90 top
R22  44.77,23.95 0 top
R23  20.57,25.9 270 top
R25  43.48,21.26 90 top
R26  52.53,23.67 180 top
R27  20.44,17.1 90 top
R28  22.83,17.13 90 top
R29  24.91,17.09 90 top
R30  11.43,13.2 180 top
R31  11.43,15.23 0 top
R32  45.72,44.19 270 top
R33  23.11,25.9 270 top
R34  25.65,25.9 270 top
R36  8.38,23.87 270 top
R37  19.05,28.19 180 bottom
R38  19.05,30.22 180 bottom
R39  19.05,32.25 180 bottom
R40  19.05,26.15 180 bottom
R41  19.05,34.28 180 bottom
R42  47.75,44.19 90 top
R43  41.15,44.19 90 top
S1  23.48,21.45 0 top
S2  50.98,51.13 270 top
T1  42.76,17.48 0 top
T2  49.6,17.41 0 top
U1  17.42,40.98 90 top
U2  33.5,33.5 90 top
U17  34.24,20.19 0 top
U$1  33.5,47.71 0 top
U$2  16.05,51.27 0 top
U$3  58.37,49.71 90 top
U$10  1.1,46.15 270 top
U$11  11.18,17.26 270 bottom
U$13  59.18,19.3 90 top
U$15  [LOGO]  12.72,16.6 90 top
U$16  17.02,38.85 270 bottom
U$17  43.43,44.44 90 top
X1  3.88,17.1 90 top
X2  48.44,28.73 90 top
X7  51.54,7.25 0 top
X8  26.18,43.95 0 top
X9  15.48,7.25 0 top

### Tracks (layer width: path | path; a pad name or v marks a point on that pad's centre or on a via)
+3V3  (via drill 0.35)
  Top 0.203: X2.4 50.74,26.85 v50.8,26.92 | C40.1 12.63,38.85 C19.1 v8.64,38.85 | C40.1 12.77,38.79 | C20.1 14.42,52.62 U$2.P$1 | v49.02,54.86 18.29,54.86 17.53,54.09 13.89,54.09 C20.1 | C20.1 v10.41,52.62 8.68,52.62 v8.13,52.06 | v3.3,11.93 3.81,11.42 v10.16,11.42 10.16,10.41 10.41,10.15 v16.76,10.15 | v10.41,24.63 11.01,24.63 C23.2 | v2.79,36.82 3.05,36.57 v8.64,36.57 | LED3.A 51.68,11.68 v50.8,11.68 46.48,11.68 46.23,11.93 46.23,12.83 LED4.A | v50.8,24.88 42.42,24.88 41.91,24.38 40.86,24.38 D1.K | C40.1 14.62,36.87 18.03,36.87 | 18.03,36.87 20.73,36.87 21,37.15 v21.08,37.15 | 18.03,36.87 18.05,36.89 U1.3
  Top 0.254: R1.2 50.42,33.65 v50.8,34.03 | IC2.2 46.82,38.68 v46.74,38.6 | v46.74,36.57 46.7,36.6 41.87,36.6 41.22,37.25 U2.32 v37.85,37.25 37.67,37.25 37.08,37.84 34.37,37.84 v34.29,37.92 34.11,38.09 29.97,38.09 29.75,38.31 U2.48 | v37.85,30.73 39.18,30.73 U2.19 | v45.21,42.16 44.09,43.27 U$17.2 | U2.64 29.33,29.75 29.45,29.86 29.99,29.86 30.02,29.83 v32.26,29.83 | U2.13 35.75,28.63 36.07,28.95 v37.85,28.95
  Top 0.406: IC2.2 50.46,37.5 v50.8,37.5 C15.1 54.41,37.5 C31.+
  Bottom 0.203: v50.8,34.03 v50.8,26.92 v50.8,24.88 v50.8,11.68 | v50.8,37.5 50.8,53.08 v49.02,54.86 | v8.13,52.06 8.13,39.36 v8.64,38.85 v8.64,36.57 | v10.41,52.62 v10.41,24.63 10.41,11.68 v10.16,11.42 | v3.3,11.93 3.3,14.47 X1.5 | v16.76,10.15 16.76,20.06 16.38,20.44 U$11.2 | C22.1 20.76,37.15 v21.08,37.15 | v2.79,36.82 2.39,36.42 2.39,31.39 3.04,30.73 U$16.PIN4 | C4.1 32.57,34.48 C6.1
  Bottom 0.254: v50.8,34.03 v50.8,37.5 | C5.1 C4.1 32.5,32.19 C1.1 32.26,31.94 v32.26,29.83 | C6.1 34.11,34.51 C7.1 34.29,37.07 v34.29,37.92 | v46.74,36.57 v46.74,38.6 45.21,40.12 v45.21,42.16 | v37.85,37.25 v37.85,30.73 v37.85,28.95 | C22.1 19.9,36.29 R41.2 R39.2 R38.2 R37.2 R40.2
+5V  (via drill 0.35)
  Top 0.406: C36.+ 61.84,31.3 C35.1 60.11,30.16 IC3.2 56.83,30.16 v56.39,29.71 | v54.1,1.77 v41.91,1.77 v9.91,1.77 | U17.8 38.14,22.09 C37.2 39.23,21.07 v41.91,21.07
  Bottom 0.406: v56.39,29.71 56.39,10.41 55.63,9.64 55.63,7.87 54.36,6.6 54.36,2.66 v54.1,1.77 | v41.91,1.77 v41.91,21.07 | v9.91,1.77 9.91,8.64 X9.1
+12V  (via drill 0.35)
  Top 0.406: C14.1 53.98,41 C12.+ | C12.+ 50.23,41.94 IC2.3 47.86,42.41 46.23,42.41 45.72,42.92 R32.2 | C34.+ 59.47,33.8 | 59.47,33.8 C33.1 | 59.47,33.8 59.47,33.77 IC3.3 | C12.+ 48,46.98 v40.89,46.98
  Top 1.27: v64.26,10.66 56.29,10.66 X7.4 X7.3 X7.2 X7.1 | v64.98,33.77 62.71,33.77 C34.+ | v64.98,40.63 57.22,40.63 C14.1
  Bottom 0.406: v40.89,46.98 40.37,47.51 IC1.3 40.37,59.48 C32.+ 41.57,63.94 C29.1
  Bottom 1.27: D2.K 65.21,42.78 C38.+ v64.98,40.63 v64.98,33.77 64.98,11.38 v64.26,10.66
AGND  (via drill 0.35)
  Top 0.203: C27.2 39.59,12.98 v39.62,12.95 | v38.61,17.77 37.22,17.77 U17.5 | 16.26,10.66 15.88,10.66 15.76,10.54 13.84,10.54 v13.46,10.91
  Bottom 0.203: v39.62,12.95 39.62,15.74 v39.37,15.99 39.37,17.01 v38.61,17.77
  other vias: 13.72,7.36 18.29,10.41 21.34,10.66 28.7,16.25 23.88,11.17 37.34,15.99 37.59,11.74 34.54,19.8 33.53,20.82 37.34,23.61 38.61,22.85 32,23.61 25.81,11.35 29.26,12.76 27.81,20.22
  pour Bottom: 37.08,26.41 30.73,26.41 29.72,25.39 29.72,23.61 27.94,21.84 27.43,21.84 27.43,11.42 10.67,11.42 8.38,9.14 8.38,4.82 10.16,3.04 14.99,3.04 15.24,3.55 15.24,7.1 14.22,8.37 14.22,9.9 14.99,9.9 15.75,10.66 37.59,10.66 40.39,13.45 40.13,22.09 38.61,23.61 38.61,24.88
  pour Top: 37.08,26.41 30.73,26.41 29.72,25.39 29.72,23.61 27.94,21.84 27.43,21.84 27.43,11.42 10.67,11.42 8.38,9.14 8.38,4.82 10.16,3.04 14.99,3.04 15.24,3.55 15.24,7.1 14.22,8.37 14.22,9.9 14.99,9.9 15.75,10.66 37.59,10.66 40.39,13.45 40.13,22.09 38.61,23.61 38.61,24.88
BATT_CLOCK  (via drill 0.35)
  Top 0.254: U$13.+ 59.09,25.39 v55.37,25.39 | v55.37,13.71 55.37,13.71 45.65,13.71 45.51,13.86 29.79,13.86 29.62,14.02 29.62,14.06 28.7,14.98 v26.67,14.98 | v26.92,25.39 27.09,25.56 28.53,25.56
  Top 0.305: C2.1 28.53,25.56 29.75,26.78 U2.1
  Bottom 0.254: v55.37,25.39 v55.37,13.71 | v26.67,14.98 26.67,25.14 v26.92,25.39
BATT_VOLT  (via drill 0.35)
  Top 0.203: 39.03,43.43 C3.1 35.74,43.34 v35.31,42.91 | U2.9 33.78,27.83 33.78,28.69 34.29,29.2 v34.8,29.2
  Top 0.254: R43.1 C3.1
  Bottom 0.203: v34.8,29.2 34.8,33.79 34.92,33.92 34.92,42.52 v35.31,42.91
CAN_RX  (via drill 0.35)
  Top 0.203: v21.34,38.6 19.4,38.6 U1.4 | v21.59,41.46 22.37,41.46 22.41,41.42 30.83,41.42 31.75,40.5 U2.44
  Bottom 0.203: v21.59,41.46 21.59,38.85 v21.34,38.6
CAN_TX  (via drill 0.35)
  Top 0.203: U1.1 15.51,39.38 15.98,39.84 20.04,39.84 v20.57,39.31 | U2.45 31.24,39.2 31.24,40.5 30.68,41.07 22.09,41.07 21.85,40.83 v20.57,40.83
  Bottom 0.203: v20.57,40.83 v20.57,39.31
CANH  (via drill 0.35)
  Top 0.203: U$10.P$4 C16.1 10.58,41.82 12.18,41.82 12.63,41.37 R2.1 14.25,41.37 14.99,40.63 16.26,40.63 v16.51,40.89 17.14,41.52 | 17.14,41.52 19.75,41.52 21.34,43.11 21.45,43.11 21.53,43.19 23.43,43.19 23.87,42.75 26.69,42.75 26.79,42.86 v27.18,42.86 | 17.14,41.52 17.14,43.09 U1.7
  Bottom 0.203: v27.18,42.86 26.1,42.86 25.53,43.43 25.53,44.37 X8.3
CANL
  Top 0.203: U$10.P$3 4.68,44.44 7.37,44.44 8.48,43.33 C17.1 10.55,42.58 12.15,42.58 12.64,43.07 R2.2 13.56,43.9 14.36,44.7 17.78,44.7 18.05,44.42 U1.6 18.05,44.21 18.54,44.7 22.43,44.7 23.99,43.13 26.52,43.13 26.54,43.11 26.8,43.37 X8.2
DUPA  (via drill 0.35)
  Top 0.203: S2.1 S2.4 50.33,50.53 C11.1 45.56,53.03 23.05,53.03 23,53.08 v22.61,53.08 | v22.61,58.92 21.56,59.71 U$1.5
  Bottom 0.203: v22.61,53.08 v22.61,58.92
FLASH_CS  (via drill 0.35)
  Top 0.203: U2.33 37.67,39.62 v38.6,39.62 | v38.86,46.22 37.97,47.11 13.84,47.11 v13.46,46.73 | v13.46,15.23 R31.2
  Bottom 0.203: v38.6,39.62 38.86,39.88 v38.86,46.22 | v13.46,15.23 13.21,15.49 13.08,15.62 13.08,40.13 13.08,46.28 13.46,46.66 v13.46,46.73
FLASH_MISO  (via drill 0.35)
  Top 0.203: v37.08,48.51 36.66,48.1 15.27,48.1 14.99,48.38 9.78,48.38 v9.4,48 | v9.4,13.2 R30.2 | U2.35 36.25,40.07 v37.46,41.27
  Bottom 0.203: v9.4,48 v9.4,13.2 | v37.46,41.27 37.46,46.98 36.96,47.48 36.96,48.01 37.08,48.12 v37.08,48.51
FLASH_MOSI  (via drill 0.35)
  Top 0.203: U2.36 35.75,40.59 v36.55,41.39 | v36.17,48.76 11.43,48.76 v11.18,49.01 | v11.43,20.31 11.43,20.15 R19.2
  Bottom 0.203: v36.55,41.39 37.08,41.93 37.08,46.73 36.32,47.49 36.32,48.61 v36.17,48.76 | v11.18,49.01 11.18,20.57 v11.43,20.31
FLASH_RESET  (via drill 0.35)
  Top 0.203: U2.25 38.06,33.75 37.49,33.17 34.04,33.17 33.78,32.92 v33.78,32.89 | v33.53,30.98 31.11,30.98 v30.99,31.1 | v8.64,12.44 9.02,12.05 20.57,12.05 | 20.58,12.05 20.57,12.05 | v8.77,17.26 R17.1 | 20.57,12.05 29.57,12.05 v29.72,11.9
  Bottom 0.203: v33.78,32.89 33.53,32.64 v33.53,30.98 | v30.99,31.1 30.99,26.79 30.61,26.42 30.61,23.87 30.61,23.74 32,22.34 32,12.95 31.5,12.44 30.25,12.44 v29.72,11.9 | v8.64,12.44 8.64,17.13 v8.77,17.26
FLASH_SCK  (via drill 0.35)
  Top 0.203: v37.59,47.74 v14.73,47.74 | v13.97,21.33 R18.2 | v38.1,40.63 37.67,40.2 36.99,40.2 36.75,39.96 U2.34
  Bottom 0.203: v13.97,21.33 13.97,27.55 14.35,27.92 14.35,28.45 14.07,28.72 14.07,40.48 14.48,40.89 14.48,44.7 14.73,44.95 v14.73,47.74 | v38.1,40.63 38.1,47.24 v37.59,47.74
GND  (via drill 0.35)
  Top 0.203: v29.21,31.49 28.8,31.08 28.8,30.49 28.56,30.25 U2.63 | U2.18 38.26,30.25 38.11,30.09 37.85,30.09 37.34,29.58 35.77,29.58 v35.73,29.54 35.73,29.15 35.35,28.77 35.35,27.89 U2.12 | C20.2 12.69,50.64 U$2.P$3 U$2.P$2 | C19.2 10.64,36.89 | LED9.C 25.5,13.1 25.91,12.69 | U2.31 39.1,36.65 38.34,36.65 38.26,36.57 37.85,36.57
  Top 1.27: v60.2,5.58 55.94,5.58 X7.9 X7.8 X7.7
  Bottom 0.203: C1.2 30.11,31.49 v29.21,31.49 | C6.2 v35.78,31.74 35.78,29.59 v35.73,29.54
  Bottom 1.27: U$3.P$2 61.37,42.75 C38.- 62.99,40.73 62.99,11.93 60.2,9.14 | 60.2,9.14 v60.2,5.58 | X7.5 59.74,8.68 60.2,9.14
  other vias: 29.97,35.81 31.5,35.81 22.61,39.87 27.18,39.87 28.96,39.87 29.21,43.17 21.34,49.52 28.7,51.55 23.11,51.81 21.84,53.84 19.05,53.59 18.54,55.62 10.67,54.09 9.4,51.3 9.4,49.52 12.7,49.52 6.6,49.78 6.6,47.74 6.6,54.09 6.86,42.41 12.19,44.95 6.6,45.2 15.49,41.65 11.94,47.24 6.86,35.55 14.73,25.65 8.38,27.42 5.08,28.44 6.1,30.73 4.83,35.55 12.19,35.04 12.19,30.98 17.78,23.61 17.53,20.82 17.78,19.3 17.78,17.26 3.56,21.58 5.08,12.44 5.08,15.49 1.52,12.18 1.52,13.71 23.88,14.22 21.59,14.22 19.3,14.22 25.91,19.55 25.91,23.36 27.37,23.11 28.19,27.68 28.45,26.92 48.51,32 53.34,26.15 57.66,26.15 52.83,34.03 60.71,38.09 58.93,42.92 57.4,44.19 58.17,45.97 56.9,46.73 49.78,47.49 49.02,49.27 50.04,51.55 53.34,53.33 57.15,55.36 54.86,55.62 44.7,64.25 50.04,61.71 48.77,57.65 48.77,63.75 32.51,60.19 32.26,65.02 33.78,66.03 40.64,66.29 47.5,66.79 29.97,66.79 26.16,64.51 21.08,64.76 18.8,61.97 18.54,65.02 17.53,62.48 13.72,59.94 19.3,57.9 27.18,58.67 31.5,57.9 32.26,55.87 27.94,55.62 32.51,53.84 27.69,53.84 32.26,51.05 41.91,49.78 34.8,50.79 58.93,49.78 59.44,53.08 63.75,53.33 61.47,55.36 58.67,38.6 52.07,39.36 54.86,40.12 59.94,20.57 58.17,18.03 58.93,12.69 54.36,19.8 46.74,40.89 49.53,43.43 55.12,46.73 14.73,30.98 8.38,30.98 14.99,27.42 6.6,27.42 16.51,23.11 57.66,12.18 57.91,7.1 62.23,4.06 57.66,3.55 51.82,3.8 60.71,18.28 39.12,28.95 39.12,27.13 42.02,27.12 46.23,26.95 50.04,28.99 50.04,30.76 49.28,35.08 42.06,34.85 38.25,38.41 43.08,41.46 41.16,40.42 42.43,46.22 43.01,47.82 43.19,49.78 54.62,44.44 48.51,53.59 36.98,36.38 7.37,37.58 6.86,40.12 20.57,43.68 14.71,39.58 46.34,35.56
  pour Bottom: 7.87,10.15 7.87,0.25 7.37,-0.26 -0.51,-0.26 -1.27,0.5 -1.27,64 6.6,71.87 61.98,71.87 69.34,64.51 69.34,-0.77 66.29,-3.82 52.32,-3.82 49.78,-1.28 49.78,3.87 49.09,4.56 49.09,7.04 48.77,7.36 48.51,7.36 47.75,8.12 47.75,9.39 48.26,9.9 52.83,9.9 54.61,11.68 54.61,16.25 53.34,17.52 53.34,22.34 53.09,22.6 53.09,24.38 51.82,25.65 38.86,25.65 37.59,26.92 30.48,26.92 28.96,25.39 28.96,23.36 28.19,22.6 27.69,22.6 26.99,21.9 26.99,12.25 9.97,12.25
  pour Top: 7.87,8.88 7.87,0.25 7.37,-0.26 -0.51,-0.26 -1.27,0.5 -1.27,64 6.6,71.87 61.98,71.87 69.34,64.51 69.34,-0.77 66.29,-3.82 52.32,-3.82 49.78,-1.28 49.78,3.87 49.09,4.56 49.09,7.04 48.77,7.36 48.51,7.36 47.75,8.12 47.75,9.39 48.26,9.9 52.83,9.9 54.61,11.68 54.61,16.25 53.34,17.52 53.34,22.34 53.09,22.6 53.09,24.38 51.82,25.65 38.86,25.65 37.59,26.92 30.48,26.92 28.96,25.39 28.96,23.36 28.19,22.6 27.69,22.6 26.99,21.9 26.99,12.25 9.97,12.25 7.87,10.15
GND1  (via drill 0.35)
  other vias: 43.99,19.26 44.67,22.85 50.16,23 42.76,15.39 42.84,12.93 51.87,12.97 51.87,15.76 51.87,18.56 51.61,20.59 47.8,20.59 47.8,19.32 48.31,17.8 42.98,9.16 42.98,4.59 38.66,4.08 25.2,5.6 31.55,9.16 35.36,9.16
  pour Bottom: 39.12,25.14 51.31,25.14 52.58,23.87 52.58,17.01 53.85,15.74 53.85,11.93 52.83,10.91 47.5,10.91 47.24,10.66 47.24,7.36 47.75,6.85 48.51,6.85 48.51,2.79 48.26,2.28 16,2.28 15.75,2.53 15.75,6.85 16,7.1 22.61,7.1 24.64,9.14 37.85,9.14 40.89,12.18 40.89,22.34 39.12,24.12
  pour Top: 39.12,25.14 51.31,25.14 52.58,23.87 52.58,17.01 53.85,15.74 53.85,11.93 52.83,10.91 47.5,10.91 47.24,10.66 47.24,7.36 47.75,6.85 48.51,6.85 48.51,2.79 48.26,2.28 16,2.28 15.75,2.53 15.75,6.85 16,7.1 22.61,7.1 24.64,9.14 37.85,9.14 40.89,12.18 40.89,22.34 39.12,24.12
IGN_TEST  (via drill 0.35)
  Top 0.203: v24.89,34.91 25.23,35.25 U2.53 | v27.43,18.79 24.89,18.79 24.28,19.4 v24.28,20.06
  Top 0.254: R5.1 45.8,18.58 T1.C 39.89,18.58 39.81,18.51 38.15,18.51 37.71,18.94 30.66,18.94 30.03,18.31 29.74,18.31 29.21,17.77 v27.43,17.77
  Bottom 0.203: v27.43,17.77 v27.43,18.79 | v24.28,20.06 24.28,27.61 | 24.28,34.43 24.75,34.91 v24.89,34.91
  Bottom 0.254: 24.28,27.61 24.23,27.66 24.23,29.11 24.28,29.15 24.28,34.43
IGNITION  (via drill 0.35)
  Top 0.254: R25.1 41.22,20.41 v41.15,20.34 | v36.32,42.66 38.34,42.66 38.5,42.51 41.05,42.51 v41.4,42.16 | v35.55,41.39 35.25,41.09 U2.37
  Bottom 0.254: v41.15,20.34 41.15,25.99 41.3,26.14 41.3,35.19 41.91,35.81 41.91,41.65 v41.4,42.16 | v36.32,42.66 35.55,41.9 v35.55,41.39
KEY_IN  (via drill 0.35)
  Top 0.406: v45.21,10.41 v48.51,10.41 | v47.24,12.95 48.34,12.95 R12.1
  Top 1.27: X9.9 v23.37,5.83 | v23.88,9.9 26.13,9.9 26.66,10.43 40.36,10.43 40.38,10.41 v45.21,10.41 | v45.47,19.55 46.1,19.55 Q2.3
  Bottom 0.406: v48.51,10.41 48.51,11.68 v47.24,12.95
  Bottom 1.27: v23.37,5.83 23.37,9.39 v23.88,9.9 | v45.21,10.41 45.21,19.3 v45.47,19.55
KEY_OUT  (via drill 0.35)
  Top 0.406: R3.1 42.7,11.68 v43.94,11.68 | v43.94,5.83 X7.6
  Top 1.27: v45.21,3.29 40.64,3.29 40.13,2.79 17.02,2.79 v16.76,3.04
  Bottom 0.406: v43.94,11.68 v43.94,5.83
  Bottom 1.27: X7.6 45.21,3.66 v45.21,3.29 | v16.76,3.04 16.76,5.73 X9.8
KEY_TEST  (via drill 0.35)
  Top 0.203: T2.C 47.9,18.52 46.84,17.45 40.83,17.45 40.13,16.76 37.34,16.76 36.58,17.52 29.5,17.52 29.12,17.14 v23.79,17.14 v23.78,17.13 | v23.11,35.81 23.55,36.25 U2.51
  Top 0.254: T2.C 49.6,19.94 R21.1
  Bottom 0.203: v23.78,17.13 23.78,17.99 22.99,18.78 22.99,19.3 23.24,19.55 23.24,30.09 22.86,30.47 22.86,35.55 v23.11,35.81
MS56_CS  (via drill 0.35)
  Top 0.203: 17.02,49.39 U$2.P$4 | 17.02,49.39 U$2.P$5 | U2.20 43.29,31.25 43.68,30.86 44.2,30.86 44.58,31.23 v46.23,31.23 | v47.5,56.63 21.34,56.63 v21.08,56.89 | v19.81,49.39 17.02,49.39
  Bottom 0.203: v46.23,31.23 46.23,32.03 46.25,32.05 46.25,34.3 47.75,35.81 47.75,56.38 v47.5,56.63 | v21.08,56.89 21.08,50.66 v19.81,49.39
MS56_MISO  (via drill 0.35)
  Top 0.203: v40.64,34.28 40.64,34 41.11,33.53 41.11,33 40.36,32.25 U2.22 | v39.12,49.52 36.2,52.44 v18.99,52.44 | v18.8,50.28 18.43,50.64 U$2.P$6
  Bottom 0.203: v40.64,34.28 40.64,35.86 39.91,36.59 39.91,48.72 v39.12,49.52 | v18.99,52.44 18.8,52.25 v18.8,50.28
MS56_MOSI  (via drill 0.35)
  Top 0.203: U2.23 39.96,32.75 v40.48,33.27 | U$2.P$7 17.82,51.89 18.8,50.92 25.53,50.92 26.67,49.78 37.85,49.78 v38.1,49.52
  Bottom 0.203: v38.1,49.52 38.1,48.13 39.49,46.74 39.49,34.25 v40.48,33.27
MS56_SCLK  (via drill 0.35)
  Top 0.203: U2.21 43.68,31.75 v43.94,31.49 | v43.18,54.22 42.8,54.22 42.52,54.5 18.5,54.5 U$2.P$8
  Bottom 0.203: v43.94,31.49 43.94,34.28 44.08,34.41 44.08,53.32 v43.18,54.22
N$1  (via drill 0.35)
  Top 0.203: 8.29,23.11 R36.2 8.37,23 v6.31,23
  Bottom 0.203: v6.31,23 6.32,23.14 U$16.DETECT
N$2  (via drill 0.35)
  Top 0.203: 40.04,39.27 C18.1 | 40.04,39.27 40.2,39.11 | v41.15,36.25 U2.30 | v41.15,38.35 40.23,39.27 40.04,39.27
  Bottom 0.203: v41.15,38.35 v41.15,36.25
N$3  (via drill 0.35)
  Top 0.203: v30.23,16.5 C25.1 33.36,15.23 R9.2 C26.2 | v30.48,22.85 31.02,22.85 U17.1
  Bottom 0.203: v30.23,16.5 30.23,22.6 v30.48,22.85
N$4  (via drill 0.35)
  Top 0.203: C27.1 R8.2 35.48,14.8 35.05,15.23 C25.2 35.31,16.76 v36.32,16.76
  Top 0.254: v35.05,18.28 U17.4
  Bottom 0.203: v36.32,16.76 35.05,18.03 v35.05,18.28
N$5
  Top 0.254: T1.B 41.81,15.13 R3.2 R4.2
N$6
  Top 0.406: R42.2 R32.1 45.27,45.48 U$17.3 43.41,45.46 41.91,45.46 41.49,45.04 R43.2
N$7
  Top 0.254: R14.1 54.61,52.59 LED1.A
N$8  (via drill 0.35)
  Top 0.203: 31.77,24.65 35.99,24.65 36.73,25.39 v41.91,25.39 | U2.5 31.75,26.66 v31.24,26.15
  Top 0.254: 31.77,24.65 v31.75,24.63
  Bottom 0.203: v31.75,24.63 31.24,25.14 v31.24,26.15 | v41.91,25.39 43.06,26.54 C8.2
  Bottom 0.254: Q1.3 42.89,26.8 C8.2
N$9  (via drill 0.35)
  Top 0.254: U2.6 32.25,26.67 32.51,26.41 v40.64,26.41 | v45.21,30.47 v40.64,30.47
  Bottom 0.203: Q1.1 45.29,30.55 v45.21,30.47
  Bottom 0.254: C9.2 45.29,34.7 Q1.1 44.94,33.11 | v40.64,30.47 v40.64,26.41
N$10
  Top 0.203: R10.1 29.48,19.55 U17.3
N$11
  Top 0.254: R15.2 LED2.A
N$12
  Top 0.254: R13.2 R12.2 48.47,16.13 T2.B
N$14  (via drill 0.35)
  Top 0.254: R17.2 v13.97,17.26
  Bottom 0.254: v13.97,17.26 13.97,18.79 14.35,19.17 U$11.3
N$15
  Top 0.203: U17.2 29.48,20.82 R10.2
N$16  (via drill 0.35)
  Top 0.203: U17.7 v35.05,20.82 | v34.29,23.36 34.71,23.78 R11.1
  Bottom 0.203: v35.05,20.82 34.29,21.58 v34.29,23.36
N$17
  Bottom 1.27: U$3.P$1 63.65,51.46 D2.A
N$18  (via drill 0.35)
  Top 0.203: R14.2 52.85,48.84 52.39,48.38 44.58,48.38 44.45,48.51 38.1,48.51 37.21,49.39 37.08,49.39 | 37.09,49.39 37.08,49.39 | 37.08,49.39 v25.91,49.39 | v25.65,57.65 25.59,57.71 U$1.6
  Bottom 0.203: v25.91,49.39 25.65,49.65 v25.65,57.65
N$19  (via drill 0.35)
  Top 0.203: R15.1 55.96,48.84 v55.88,48.76 | v54.56,58.88 47.16,58.88 U$1.15
  Bottom 0.203: v55.88,48.76 55.88,57.81 54.81,58.88 v54.56,58.88
N$20
  Top 0.254: R5.2 46.18,14.41 LED4.C
N$21  (via drill 0.35)
  Top 0.254: R21.2 52.88,21.98 v52.96,21.9 | v52.96,15.42 LED3.C
  Bottom 0.254: v52.96,21.9 v52.96,15.42
N$22  (via drill 0.35)
  Top 0.254: R23.2 20.32,24.8 v20.32,23.87 | v20.32,11.42 20.07,11.17 v15.49,11.17
  Bottom 0.254: v20.32,23.87 v20.32,11.42 | v15.49,11.17 15.48,11.15 X9.3
N$23  (via drill 0.35)
  Top 0.203: X9.4 18.25,9.35 18.8,9.9 22.23,9.9 v22.29,9.96 | v22.61,23.87 22.61,24.54 R33.2
  Bottom 0.203: v22.29,9.96 22.29,19 22.58,19.29 22.58,23.84 v22.61,23.87
N$24  (via drill 0.35)
  Top 0.254: R34.2 25.15,24.54 v25.15,23.87 | v25.15,8.63 25.1,8.68 X9.5
  Bottom 0.254: v25.15,23.87 v25.15,8.63
N$25  (via drill 0.35)
  Top 0.254: R18.1 10.33,21.58 v8.38,21.58
  Bottom 0.254: v8.38,21.58 8.26,21.71 U$11.16
N$26  (via drill 3.1)  (2 unrouted)
  other vias: 33.5,44.75 52,56.5 15,56.75
N$27  (via drill 3.1)
  other vias: 33.5,6.75
N$28
  Top 0.254: R1.1 LED6.A
N$29  (via drill 0.35)
  Top 0.254: R20.2 18.54,15.04 v18.54,15.74 | v19.05,31.23 23.2,31.23 23.35,31.08 23.89,31.08 23.92,31.11 25.15,31.11 25.82,31.78 26.43,31.78 26.47,31.75 U2.60
  Bottom 0.254: v18.54,15.74 19.05,16.25 v19.05,31.23
N$30  (via drill 0.35)
  Top 0.254: R27.2 21.08,18.59 v21.08,19.04 | v21.08,33.52 21.81,34.25 U2.55
  Bottom 0.254: v21.08,19.04 v21.08,33.52
N$31
  Top 0.254: Q2.1 47.41,22.01 R6.2 47.33,23.95 R22.2
N$32  (via drill 0.35)
  Top 0.254: R19.1 v8.38,19.3
  Bottom 0.254: v8.38,19.3 8.38,20.06 8,20.44 U$11.15
N$33  (via drill 0.35)
  Top 0.203: v21.78,32.63 22.18,32.63 22.2,32.61
  Top 0.254: R28.2 21.95,18.87 v21.95,19.55 | U2.57 26.06,33.25 25.42,32.61 22.2,32.61
  Bottom 0.254: v21.95,19.55 21.49,20.01 21.49,32.23 arc-45 21.56,32.41 v21.78,32.63
N$34  (via drill 0.35)
  Top 0.254: R29.2 23.8,19.04 v23.62,19.04 | v23.62,31.74 24.08,32.2 25.59,32.2 25.63,32.25 U2.59
  Bottom 0.254: v23.62,19.04 v23.62,31.74
N$35
  Top 0.254: R25.2 43.48,23.51 R22.1 43.59,23.61 D1.A
N$36
  Top 0.203: LED7.A 20.39,16.2 R27.1
N$37
  Top 0.203: LED8.A 22.72,16.17 R28.1
N$38
  Top 0.203: LED9.A 25.05,16.09 R29.1
N$39  (via drill 0.35)
  Top 0.254: R30.1 13.72,13.2 v13.97,12.95
  Bottom 0.254: v13.97,12.95 15.26,12.95 U$11.8
N$40  (via drill 0.35)
  Top 0.254: R31.1 11.6,14.22 v13.97,14.22
  Bottom 0.254: v13.97,14.22 14.1,14.09 U$11.7
NRST  (via drill 0.35)
  Top 0.203: v29.46,22.34 29.37,22.25 S1.4 S1.1 21.36,22.32 C10.1 9.09,22.32 9.04,22.26 5.84,22.26 | U2.7 32.75,28.96 32.51,29.2 v29.72,29.2 | 5.84,22.26 5.76,22.26 | 5.84,22.26 5.61,22.26 arc45 5.43,22.19 v4.83,21.58
  Bottom 0.203: v29.46,22.34 29.46,28.95 v29.72,29.2 | X1.2 4.39,18.35 arc-45 4.57,18.28 4.75,18.46 arc45 4.83,18.64 v4.83,21.58
SD_DETECT  (via drill 0.35)
  Top 0.203: v30.73,46.22 30.48,45.97 v2.03,45.97 | v2.03,24.88 2.17,24.74 C21.1 4.6,24.72 R36.1 | U2.38 34.75,40.68 v34.29,41.14
  Bottom 0.203: v30.73,46.22 30.8,44.12 33.78,41.14 v34.29,41.14 | v2.03,45.97 v2.03,24.88
SDIO_CK  (via drill 0.35)
  Top 0.203: U2.28 37.39,35.25 v37.19,35.04 | v37.08,30.21 32.78,30.21 32.52,30.47 29.52,30.47 v29.46,30.52 | v28.45,28.95 25.68,28.95 25.16,29.47 18.77,29.47 18.76,29.46 v5.08,29.46
  Bottom 0.203: v37.19,35.04 37.08,34.93 v37.08,30.21 | v29.46,30.52 29.46,29.96 v28.45,28.95 | v5.08,29.46 3.87,29.46 U$16.PIN5
SDIO_CMD  (via drill 0.35)
  Top 0.203: v14.92,31.87 v4.95,31.87 | v15.24,36.24 15.52,36.51 21.74,36.51 22.88,37.65 28.66,37.65 28.72,37.58 v29.21,37.58 | v29.21,34.79 27.84,34.79 U2.54
  Bottom 0.203: R38.1 16.76,30.22 v14.92,31.87 14.92,35.92 v15.24,36.24 | v29.21,37.58 v29.21,34.79
  Bottom 0.254: v4.95,31.87 3.72,31.87 U$16.PIN3
SDIO_D0  (via drill 0.35)
  Top 0.203: 13.21,28.19 v13.72,28.19 | v22.1,45.33 14.1,45.33 v13.97,45.2 | U2.39 34.25,40.16 32.7,41.77 32.33,41.77 32.26,41.78 22.56,41.78 v22.14,42.2
  Top 0.254: v13.72,28.19 v17.02,28.19 | 13.21,28.19 5.84,28.19 v5.08,27.42
  Bottom 0.203: v22.14,42.2 22.1,42.24 v22.1,45.33 | v13.97,45.2 13.72,44.95 v13.72,28.19
  Bottom 0.254: R37.1 v17.02,28.19 | v5.08,27.42 U$16.PIN7
SDIO_D1  (via drill 0.35)
  Top 0.203: U2.26 38.06,34.25 37.34,33.53 31.5,33.53 31.23,33.25 v30.23,33.25 | v27.43,26.41 27.05,26.02 26.66,26.02 26.44,25.8 19.92,25.8 19,24.88 v17.27,24.88
  Top 0.254: v17.27,24.88 15.75,26.41 v5.08,26.41
  Bottom 0.203: v30.23,33.25 28.18,33.25 27.43,32.5 v27.43,26.41
  Bottom 0.254: R40.1 17.27,25.23 v17.27,24.88 | v5.08,26.41 5.01,26.33 U$16.PIN8
SDIO_D2  (via drill 0.35)
  Top 0.203: v29.21,33.88 37.19,33.88 38.1,34.79 39.16,34.79 U2.27 | v17.53,40.89 19.81,40.89 19.94,41.02 19.94,41.09 21.68,42.83 22.95,42.83 23.62,42.16 27.92,42.16 v28.19,42.43
  Top 0.254: v16,35.55 14.48,34.03 v4.95,34.03
  Bottom 0.203: v16,35.55 17.4,36.95 17.4,36.96 17.53,37.09 v17.53,40.89 | v28.19,42.43 28.19,34.9 v29.21,33.88
  Bottom 0.254: v4.95,34.03 U$16.PIN1 | R41.1 16.93,35.55 v16,35.55
SDIO_D3  (via drill 0.35)
  Top 0.203: U2.52 23.95,35.75 23.38,35.17 22.85,35.17 22.73,35.3 v19.05,35.3
  Top 0.254: v17.02,32.25 16.32,32.95 v4.95,32.95
  Bottom 0.203: R39.1 19.05,33.1 v19.05,35.3
  Bottom 0.254: v4.95,32.95 3.7,32.95 U$16.PIN2 | v17.02,32.25 R39.1
SERVO1_PWM  (via drill 0.35)
  Top 0.254: R23.1 22.66,28.84 v24.9,28.84 | v25.15,33.27 25.63,33.75 U2.56
  Bottom 0.254: v24.9,28.84 24.9,33.02 v25.15,33.27
SERVO2_PWM  (via drill 0.35)
  Top 0.203: R33.1 24.3,27.93 v24.89,27.93 | v26.16,31.13 26.28,31.25 U2.61
  Bottom 0.203: v26.16,31.13 26.16,31.11 25.53,30.48 25.53,28.57 v24.89,27.93
SERVO3_PWM  (via drill 0.35)
  Top 0.203: R34.1 25.65,27.68 v25.91,27.93 | v26.16,30.22 26.67,30.73 28.19,30.73 28.17,30.75 U2.62
  Bottom 0.203: v25.91,27.93 25.91,29.96 v26.16,30.22
SWCLK  (via drill 0.35)
  Top 0.203: U2.49 23.41,37.25 v22.1,35.93 | v22.15,30.22 7.75,30.22 v7.62,30.09
  Bottom 0.203: v22.1,35.93 22.1,33.62 arc45 22.17,33.45 22.5,33.11 22.5,30.68 arc-45 22.43,30.5 v22.15,30.22 | v7.62,30.09 7.62,26.66 5.99,25.03 3.19,25.03 1.78,23.62 1.78,17.26 1.94,17.1 X1.3
SWDIO  (via drill 0.35)
  Top 0.203: v1.4,39.11 1.65,39.36 8.13,39.36 8.38,39.62 9.73,39.62 9.88,39.77 13.36,39.77 14.1,40.51 14.61,40.51 14.91,40.2 16,40.2 | v1.52,15.99 1.66,15.85 X1.4 | U2.46 30.75,40.44 30.48,40.71 22.27,40.71 21.76,40.2 16,40.2 | 15.83,40.2 16,40.2
  Bottom 0.203: v1.4,39.11 1.4,16.12 v1.52,15.99
TENSO_ADC  (via drill 0.35)
  Top 0.203: R11.2 C28.1 33.25,25.57
  Top 0.254: C28.1 32.17,25.48 v32.01,25.64 | U2.8 33.25,29.43 v33.27,29.46
  Bottom 0.254: v32.01,25.64 32.01,28.19 v33.27,29.46
TENSO_IN+  (via drill 0.35)
  Top 0.254: R8.1 36.32,12.14 v36.32,11.93 | v36.32,4.06 13.1,4.06 X9.6
  Bottom 0.254: v36.32,11.93 v36.32,4.06
TENSO_IN-  (via drill 0.35)
  Top 0.254: R9.1 31.5,11.68 v30.99,11.68 | v30.73,4.82 30.48,4.56 14.48,4.56 14.09,4.95 X9.7
  Bottom 0.254: v30.99,11.68 30.73,11.42 v30.73,4.82
UART_RX
  Top 0.203: U2.17 47.6,29.75 X2.2
UART_TX
  Top 0.203: U2.16 47.69,27.8 X2.3
XBEE_RX  (via drill 0.35)
  Top 0.203: U2.43 32.25,40.25 32.13,40.37 32.13,41.01 v32,41.15 | v28.96,65.71 U$1.2
  Bottom 0.203: v32,41.15 32,41.91 29.62,44.29 29.62,63.09 28.96,63.75 v28.96,65.71
XBEE_TX  (via drill 0.35)
  Top 0.203: U2.42 32.75,40.62 v32.77,40.63 | v29.97,63.75 29.94,63.71 U$1.3
  Bottom 0.203: v32.77,40.63 32.77,41.65 29.97,44.44 v29.97,63.75
XBEE_VDD  (via drill 0.35)
  Top 0.203: v37.08,67.81 21.1,67.81 U$1.1
  Bottom 0.203: C13.+ 38.06,66.84 v37.08,67.81
  Bottom 0.406: IC1.2 38.06,60.47 C30.1 38.27,63.64 C13.+

### Text on the board
tPlace: BartoszZ | Hybrid lower pcb vol2